# EAGLE design Mixer Console PCB (EAGLE 9.6.2)

## Sheet 1 of 6: 60DB Mic Preamp
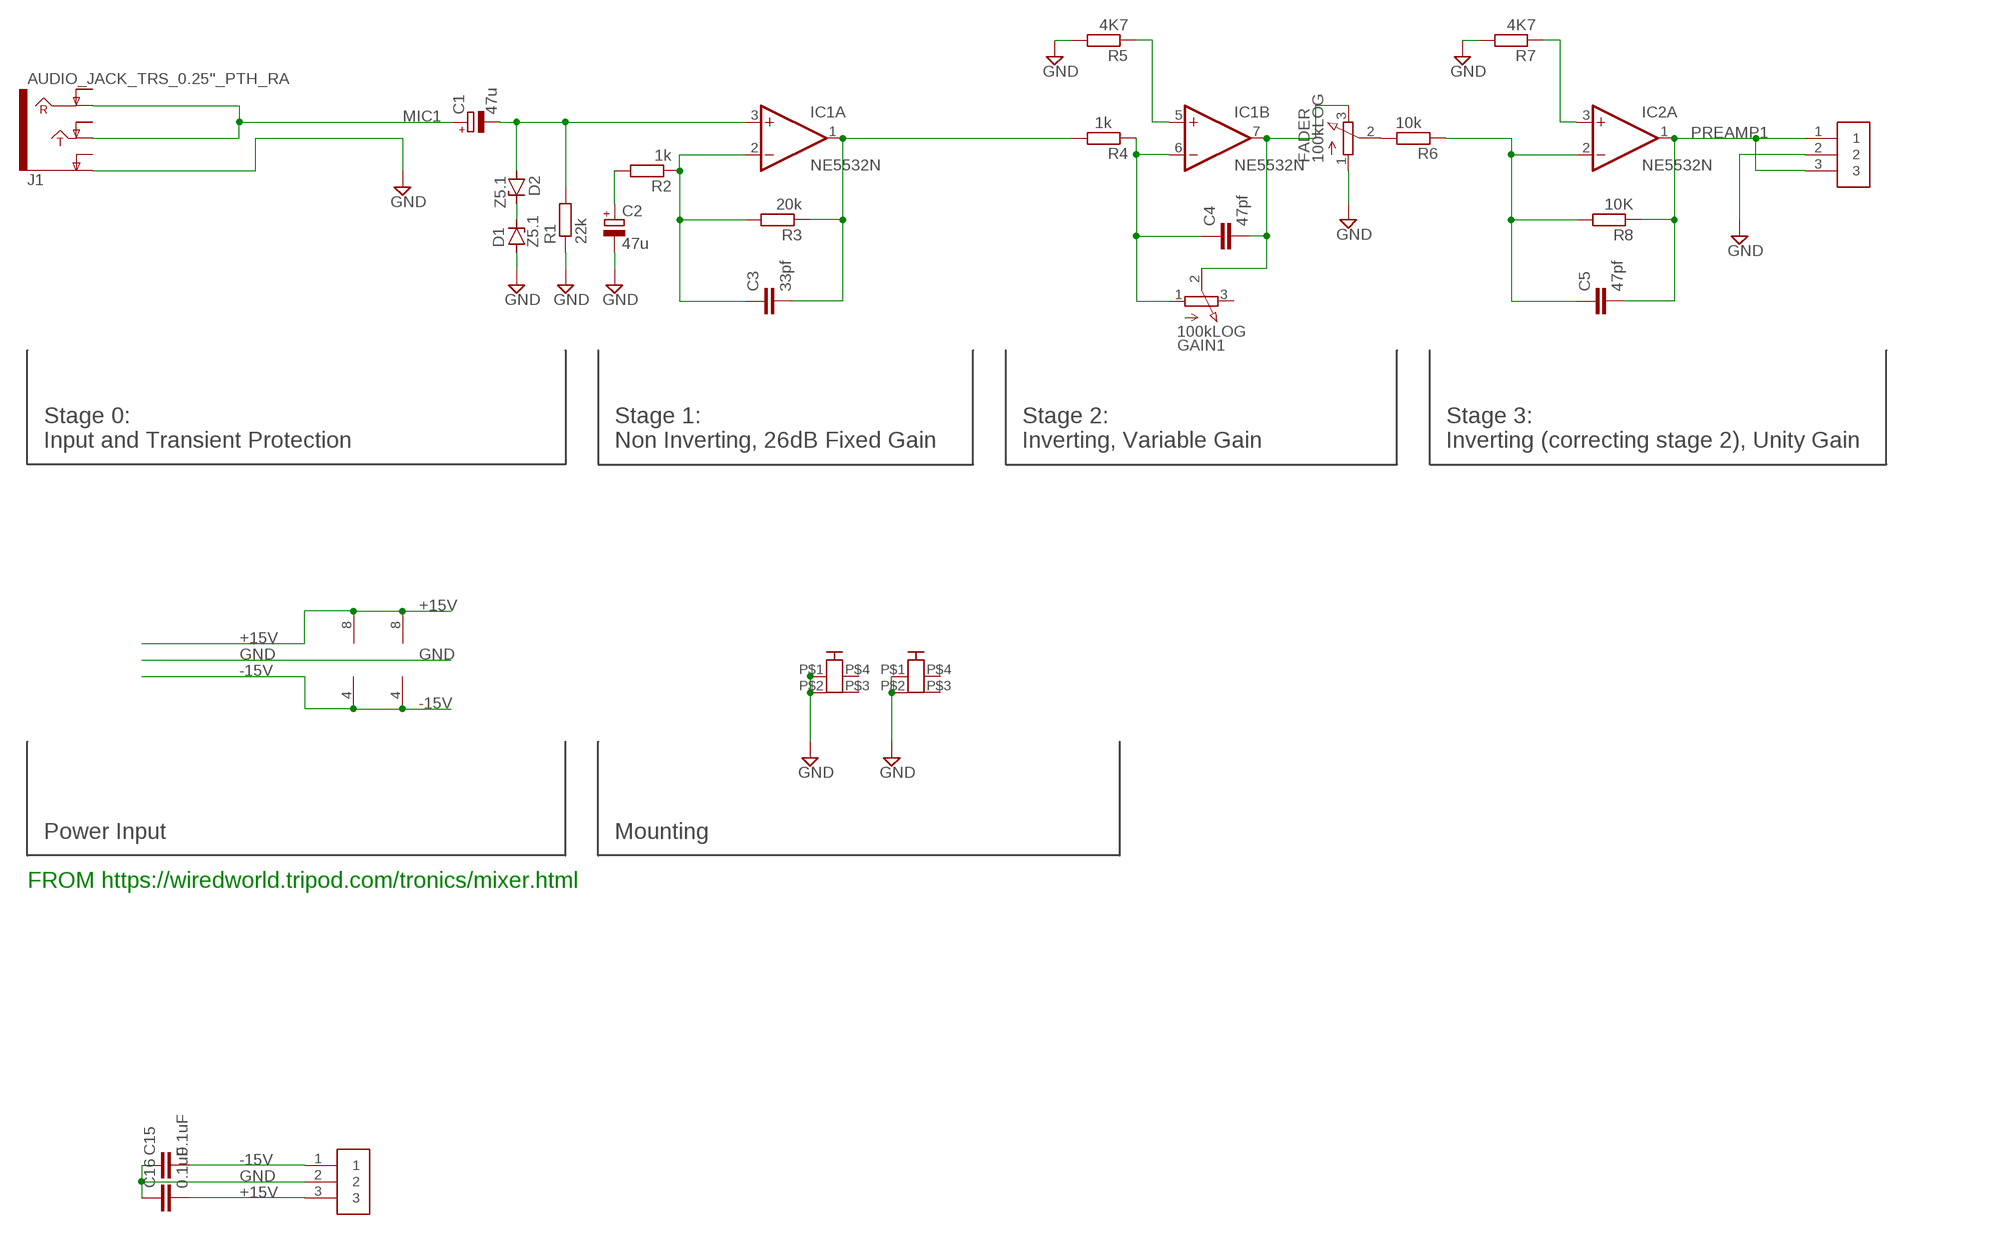
[diagram p0: schematic, sheet 1]

### Parts
C1  47u  CPOL-EUE5-6  [E5-6]
C2  47u  CPOL-EUE5-6  [E5-6]
C3  33pf  C2.5/2  [C2.5-2]
C4  47pf  C2.5/2  [C2.5-2]
C5  47pf  C2.5/2  [C2.5-2]
C15  0.1uF  C2.5/2  [C2.5-2]
C16  0.1uF  C2.5/2  [C2.5-2]
CON11  PCB-2M3  [PCB2-M3]
CON12  PCB-2M3  [PCB2-M3]
D1  Z5.1  ZENER-DIODEDO34-7  [DO34Z7]
D2  Z5.1  ZENER-DIODEDO34-7  [DO34Z7]
FADER  100kLOG  3RP/1610N  [3RP/1610N]
GAIN1  100kLOG  3RP/1610N  [3RP/1610N]
IC1  NE5532N  [DIL08]
IC2  NE5532N  [DIL08]
J1  AUDIO_JACK_TRS_0.25"_PTH_RA  [AUDIO_JACK_0.25"_TRS_PTH_RA]
PREAMPOUT  Phoenix Pluggable 3.81mm 3 way  CONNECTOR-M3  [3.81MM-3WAY-PLUGGABLE-SCREW]
PWRIN  Phoenix Pluggable 3.81mm 3 way  CONNECTOR-M3  [3.81MM-3WAY-PLUGGABLE-SCREW]
R1  22k  R-EU_0204/7  [0204/7]
R2  1k  R-EU_0204/7  [0204/7]
R3  20k  R-EU_0204/7  [0204/7]
R4  1k  R-EU_0204/7  [0204/7]
R5  4K7  R-EU_0204/7  [0204/7]
R6  10k  R-EU_0204/7  [0204/7]
R7  4K7  R-EU_0204/7  [0204/7]
R8  10K  R-EU_0204/7  [0204/7]

### Nets
+15V: C16.2 IC1.8(P:V+) IC2.8(P:V+) PWRIN.3 ; also sheet 2,3,4,5,6
-15V: C15.2 IC1.4(P:V-) IC2.4(P:V-) PWRIN.1 ; also sheet 2,3,4,5,6
GND: C2.- C15.1 C16.1 CON11.P$1 CON11.P$2 CON12.P$1 CON12.P$2 D1.A FADER.1(A) J1.SLEEVE(EARTH) PREAMPOUT.2 PWRIN.2 R1.1 R5.2 R7.2 ; also sheet 2,3,4,5,6
MIC1: C1.+ J1.RING J1.TIP
N$1: C1.- D2.A IC1.3(A:+IN) R1.2
N$2: C2.+ R2.2
N$3: C3.1 IC1.2(A:-IN) R2.1 R3.2
N$4: C3.2 IC1.1(A:OUT) R3.1 R4.2
N$5: C4.1 GAIN1.1(A) IC1.6(B:-IN) R4.1
N$6: IC1.5(B:+IN) R5.1
N$7: C4.2 FADER.3(E) GAIN1.2(S) IC1.7(B:OUT)
N$8: IC2.3(A:+IN) R7.1
N$9: D1.C D2.C
N$10: C5.1 IC2.2(A:-IN) R6.1 R8.2
N$18: FADER.2(S) R6.2
PREAMP1: C5.2 IC2.1(A:OUT) PREAMPOUT.1 PREAMPOUT.3 R8.1
Unconnected: CON11.P$3 CON11.P$4 CON12.P$3 CON12.P$4 GAIN1.3(E) IC2.5(B:+IN) IC2.6(B:-IN) IC2.7(B:OUT) J1.RING-NORM J1.SLEEVE-NORM(EARTH-NORM) J1.TIP-NORM

### Notes on the sheet
- Stage 0:
  Input and Transient Protection
- Stage 1: 
  Non Inverting, 26dB Fixed Gain
- Stage 2: 
  Inverting, Variable Gain
- Stage 3: 
  Inverting (correcting stage 2), Unity Gain
- Power Input | Mounting
- FROM https://wiredworld.tripod.com/tronics/mixer.html

## Sheet 2 of 6: BAXANDALL EQ
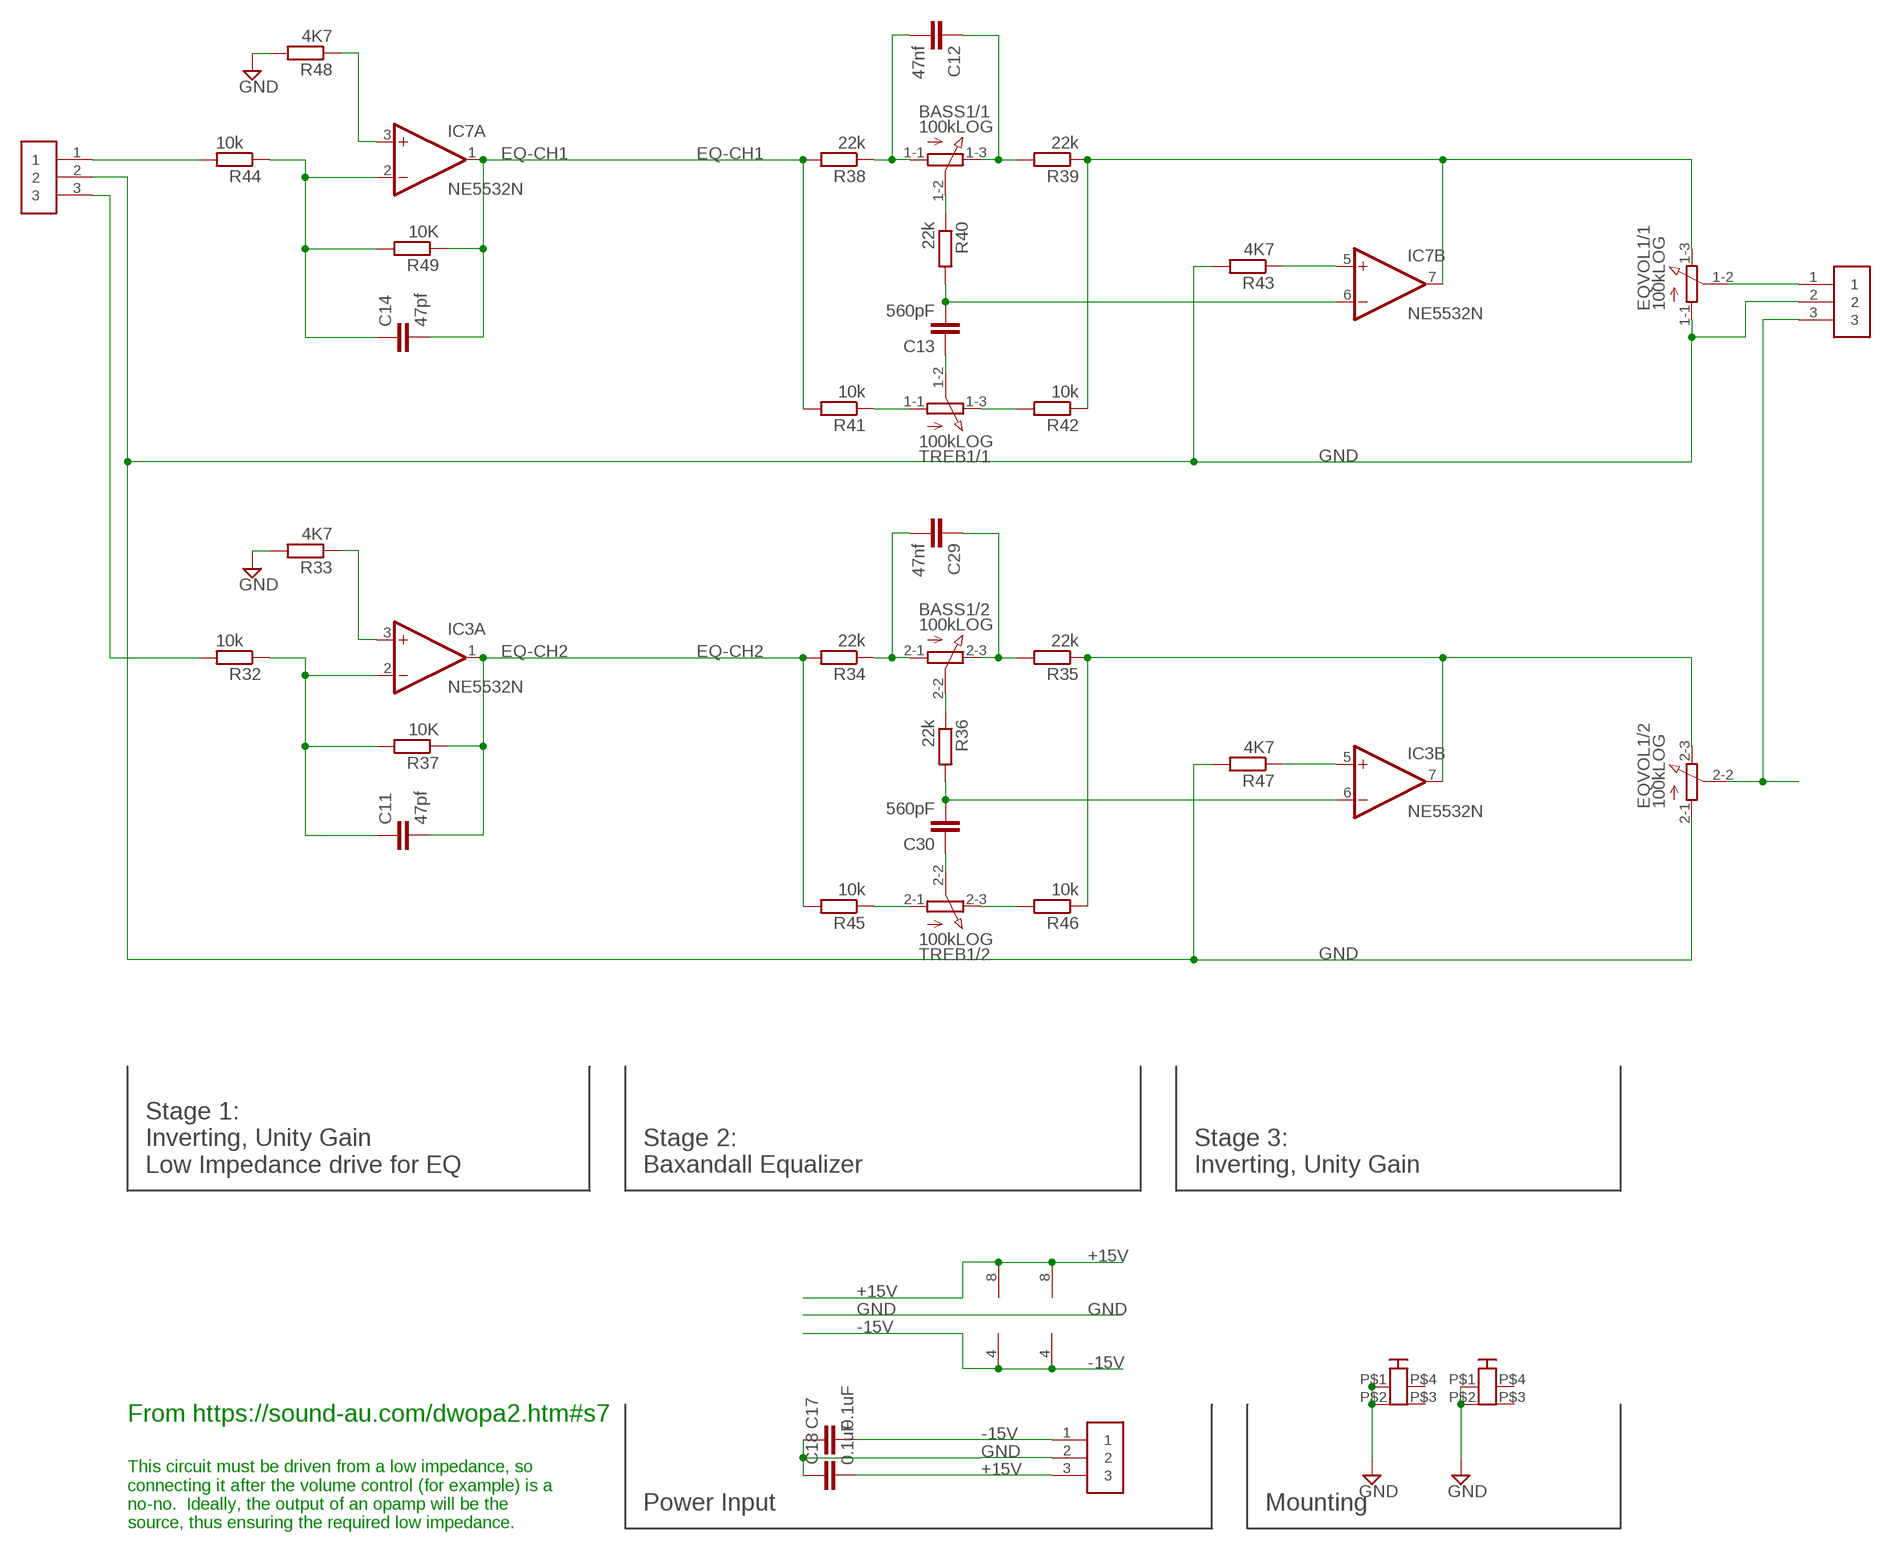
[diagram p1: schematic, sheet 2]

### Parts
BASS1  100kLOG  3RP/1610G  [3RP/1610G]
C11  47pf  C2.5/2  [C2.5-2]
C12  47nf  C2.5/2  [C2.5-2]
C13  560pF  C2.5/2  [C2.5-2]
C14  47pf  C2.5/2  [C2.5-2]
C17  0.1uF  C2.5/2  [C2.5-2]
C18  0.1uF  C2.5/2  [C2.5-2]
C29  47nf  C2.5/2  [C2.5-2]
C30  560pF  C2.5/2  [C2.5-2]
CON1  PCB-2M3  [PCB2-M3]
CON2  PCB-2M3  [PCB2-M3]
EQIN  Phoenix Pluggable 3.81mm 3 way  CONNECTOR-M3  [3.81MM-3WAY-PLUGGABLE-SCREW]
EQOUT  Phoenix Pluggable 3.81mm 3 way  CONNECTOR-M3  [3.81MM-3WAY-PLUGGABLE-SCREW]
EQVOL1  100kLOG  3RP/1610G  [3RP/1610G]
IC3  NE5532N  [DIL08]
IC7  NE5532N  [DIL08]
PWRIN1  Phoenix Pluggable 3.81mm 3 way  CONNECTOR-M3  [3.81MM-3WAY-PLUGGABLE-SCREW]
R32  10k  R-EU_0204/7  [0204/7]
R33  4K7  R-EU_0204/7  [0204/7]
R34  22k  R-EU_0204/7  [0204/7]
R35  22k  R-EU_0204/7  [0204/7]
R36  22k  R-EU_0204/7  [0204/7]
R37  10K  R-EU_0204/7  [0204/7]
R38  22k  R-EU_0204/7  [0204/7]
R39  22k  R-EU_0204/7  [0204/7]
R40  22k  R-EU_0204/7  [0204/7]
R41  10k  R-EU_0204/7  [0204/7]
R42  10k  R-EU_0204/7  [0204/7]
R43  4K7  R-EU_0204/7  [0204/7]
R44  10k  R-EU_0204/7  [0204/7]
R45  10k  R-EU_0204/7  [0204/7]
R46  10k  R-EU_0204/7  [0204/7]
R47  4K7  R-EU_0204/7  [0204/7]
R48  4K7  R-EU_0204/7  [0204/7]
R49  10K  R-EU_0204/7  [0204/7]
TREB1  100kLOG  3RP/1610G  [3RP/1610G]

### Nets
+15V: C18.2 IC3.8(P:V+) IC7.8(P:V+) PWRIN1.3 ; also sheet 1,3,4,5,6
-15V: C17.2 IC3.4(P:V-) IC7.4(P:V-) PWRIN1.1 ; also sheet 1,3,4,5,6
EQ-CH1: C14.2 IC7.1(A:OUT) R38.2 R41.2 R49.1
EQ-CH2: C11.2 IC3.1(A:OUT) R34.2 R37.1 R45.2
GND: C17.1 C18.1 CON1.P$1 CON1.P$2 CON2.P$1 CON2.P$2 EQIN.2 EQOUT.2 EQVOL1.1-1(/1:A) EQVOL1.2-1(/2:A) PWRIN1.2 R33.2 R43.2 R47.2 R48.2 ; also sheet 1,3,4,5,6
N$11: EQOUT.3 EQVOL1.2-2(/2:S)
N$12: IC3.3(A:+IN) R33.1
N$15: C11.1 IC3.2(A:-IN) R32.1 R37.2
N$23: EQIN.3 R32.2
N$36: BASS1.1-1(/1:A) C12.2 R38.1
N$42: BASS1.1-3(/1:E) C12.1 R39.2
N$43: BASS1.2-1(/2:A) C29.2 R34.1
N$44: BASS1.2-3(/2:E) C29.1 R35.2
N$45: BASS1.1-2(/1:S) R40.1
N$46: BASS1.2-2(/2:S) R36.1
N$47: C13.2 IC7.6(B:-IN) R40.2
N$48: C13.1 TREB1.1-2(/1:S)
N$49: C30.2 IC3.6(B:-IN) R36.2
N$50: EQVOL1.1-3(/1:E) IC7.7(B:OUT) R39.1 R42.1
N$51: R42.2 TREB1.1-3(/1:E)
N$52: C30.1 TREB1.2-2(/2:S)
N$53: R41.1 TREB1.1-1(/1:A)
N$54: IC7.5(B:+IN) R43.1
N$55: EQVOL1.2-3(/2:E) IC3.7(B:OUT) R35.1 R46.1
N$56: EQOUT.1 EQVOL1.1-2(/1:S)
N$57: R46.2 TREB1.2-3(/2:E)
N$58: R45.1 TREB1.2-1(/2:A)
N$59: IC7.3(A:+IN) R48.1
N$60: C14.1 IC7.2(A:-IN) R44.1 R49.2
N$61: EQIN.1 R44.2
N$65: IC3.5(B:+IN) R47.1
Unconnected: CON1.P$3 CON1.P$4 CON2.P$3 CON2.P$4

### Notes on the sheet
- Stage 1:
  Inverting, Unity Gain
  Low Impedance drive for EQ
- Stage 2:
  Baxandall Equalizer
- Stage 3:
  Inverting, Unity Gain
- From https://sound-au.com/dwopa2.htm#s7
- Power Input | Mounting
- This circuit must be driven from a low impedance, so
  connecting it after the volume control (for example) is a
  no-no.  Ideally, the output of an opamp will be the
  source, thus ensuring the required low impedance.

## Sheet 3 of 6: STEREO INPUT
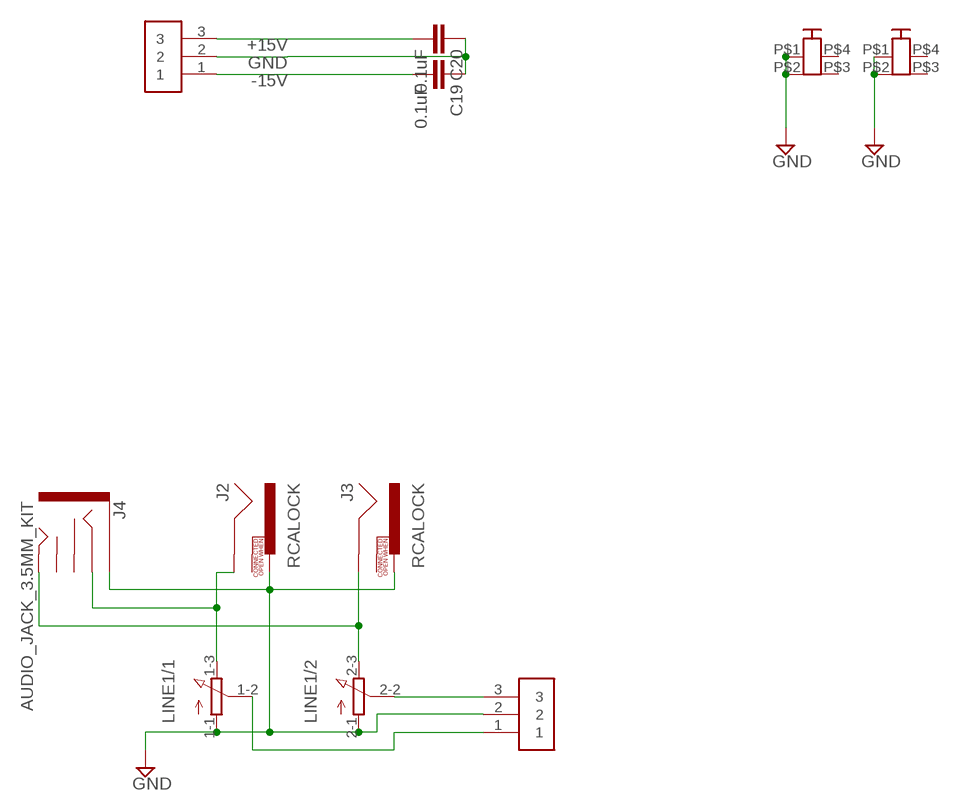
[diagram p2: schematic, sheet 3]

### Parts
C19  0.1uF  C2.5/2  [C2.5-2]
C20  0.1uF  C2.5/2  [C2.5-2]
CON3  PCB-2M3  [PCB2-M3]
CON4  PCB-2M3  [PCB2-M3]
J2  RCALOCK  [RCA_LOCK]
J3  RCALOCK  [RCA_LOCK]
J4  AUDIO_JACK_3.5MM_KIT  [AUDIO-JACK-KIT]
LINE1  3RP/1610G  [3RP/1610G]
LINEIN-OUT  Phoenix Pluggable 3.81mm 3 way  CONNECTOR-M3  [3.81MM-3WAY-PLUGGABLE-SCREW]
PWRIN2  Phoenix Pluggable 3.81mm 3 way  CONNECTOR-M3  [3.81MM-3WAY-PLUGGABLE-SCREW]

### Nets
+15V: C20.2 PWRIN2.3 ; also sheet 1,2,4,5,6
-15V: C19.2 PWRIN2.1 ; also sheet 1,2,4,5,6
GND: C19.1 C20.1 CON3.P$1 CON3.P$2 CON4.P$1 CON4.P$2 J2.PIN J3.PIN J4.SLEEVE LINE1.1-1(/1:A) LINE1.2-1(/2:A) LINEIN-OUT.2 PWRIN2.2 ; also sheet 1,2,4,5,6
N$16: LINE1.2-2(/2:S) LINEIN-OUT.3
N$17: LINE1.1-2(/1:S) LINEIN-OUT.1
N$19: J2.SHELL J4.RING LINE1.1-3(/1:E)
N$20: J3.SHELL J4.TIP LINE1.2-3(/2:E)
Unconnected: CON3.P$3 CON3.P$4 CON4.P$3 CON4.P$4 J2.SWITCH J3.SWITCH J4.RSH J4.TSH

## Sheet 4 of 6: MIXER
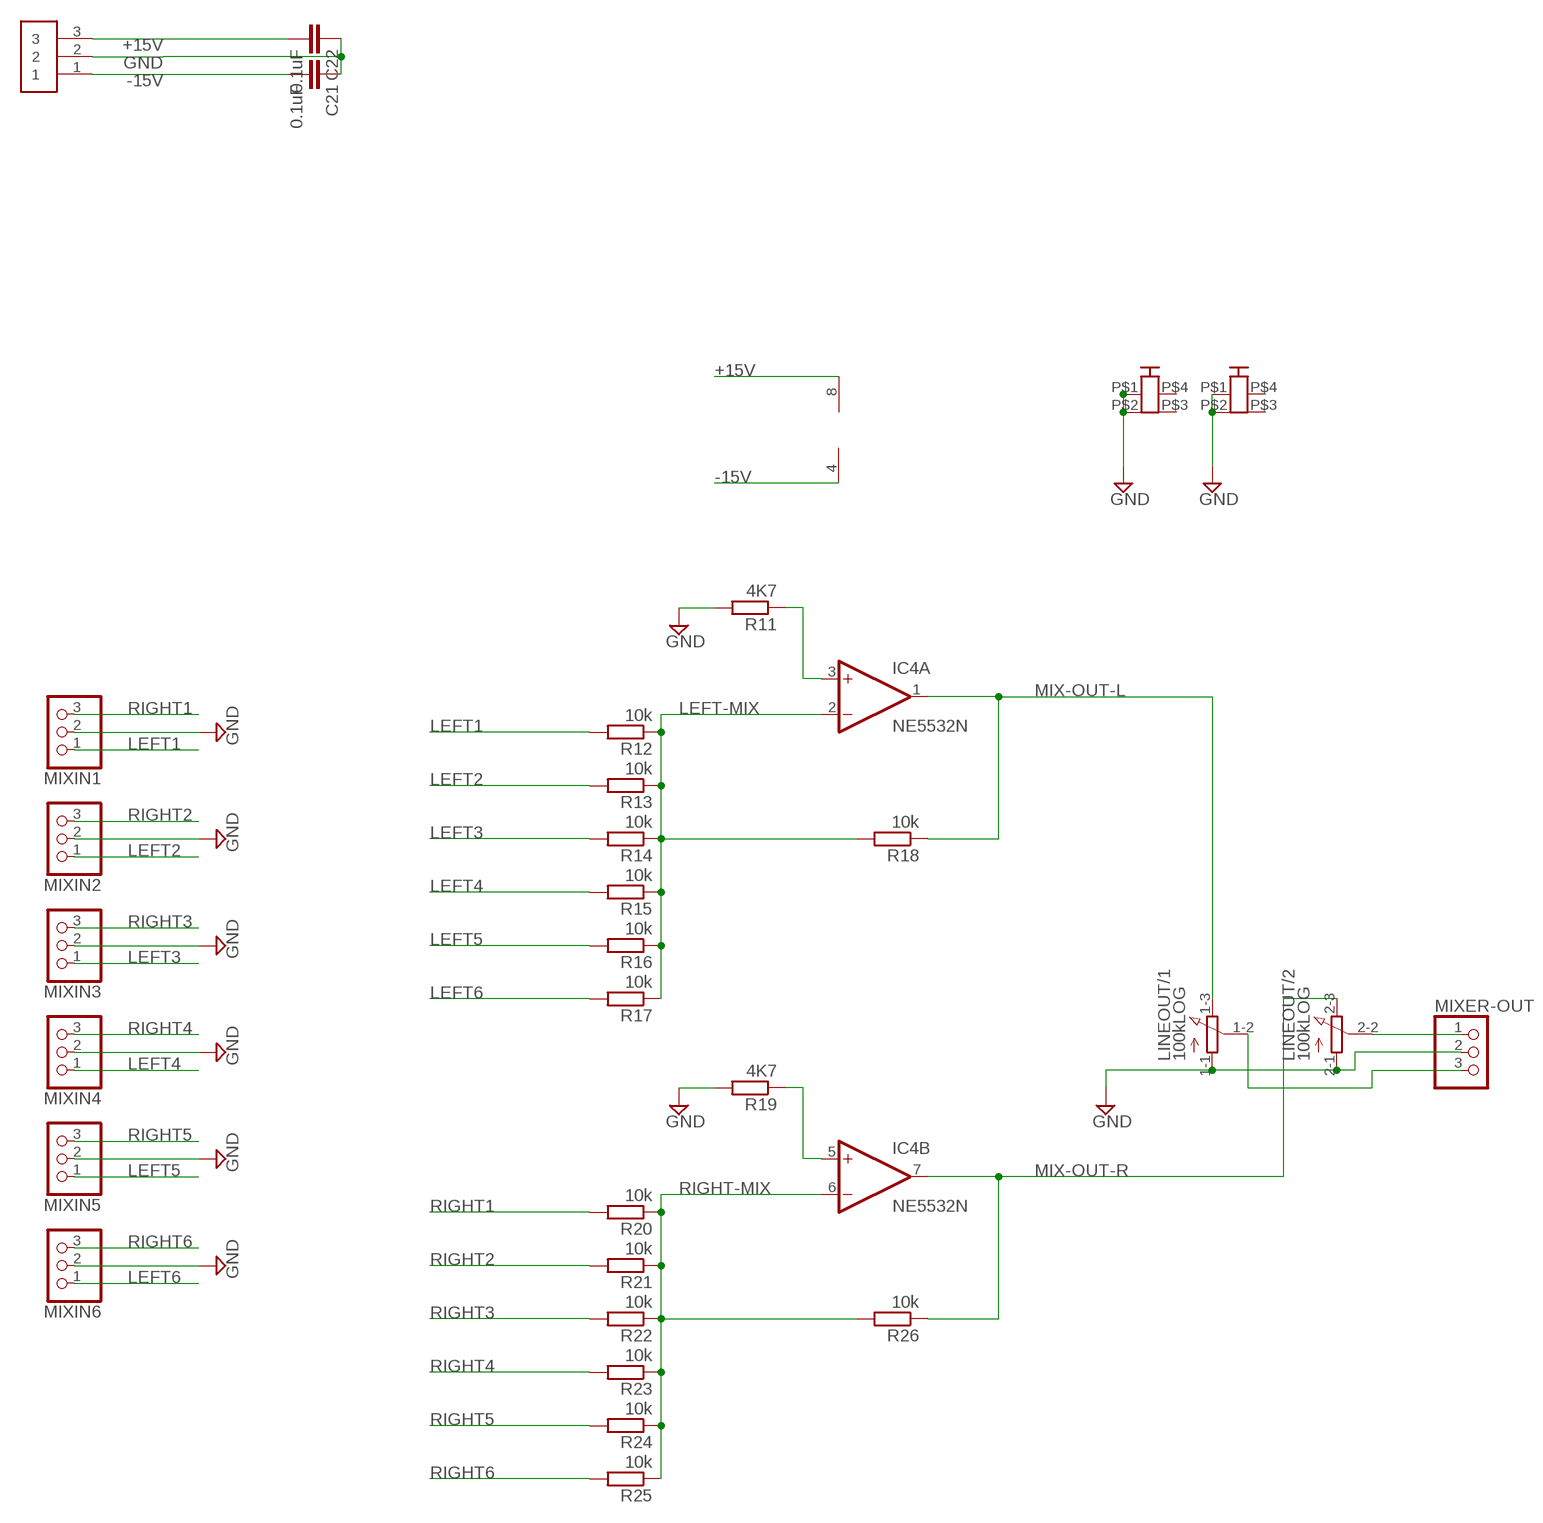
[diagram p3: schematic, sheet 4]

### Parts
C21  0.1uF  C2.5/2  [C2.5-2]
C22  0.1uF  C2.5/2  [C2.5-2]
CON5  PCB-2M3  [PCB2-M3]
CON6  PCB-2M3  [PCB2-M3]
IC4  NE5532N  [DIL08]
LINEOUT  100kLOG  3RP/1610G  [3RP/1610G]
MIXER-OUT  PINHD-1X3/90  [1X03/90]
MIXIN1  PINHD-1X3/90  [1X03/90]
MIXIN2  PINHD-1X3/90  [1X03/90]
MIXIN3  PINHD-1X3/90  [1X03/90]
MIXIN4  PINHD-1X3/90  [1X03/90]
MIXIN5  PINHD-1X3/90  [1X03/90]
MIXIN6  PINHD-1X3/90  [1X03/90]
PWRIN3  Phoenix Pluggable 3.81mm 3 way  CONNECTOR-M3  [3.81MM-3WAY-PLUGGABLE-SCREW]
R11  4K7  R-EU_0204/7  [0204/7]
R12  10k  R-EU_0204/7  [0204/7]
R13  10k  R-EU_0204/7  [0204/7]
R14  10k  R-EU_0204/7  [0204/7]
R15  10k  R-EU_0204/7  [0204/7]
R16  10k  R-EU_0204/7  [0204/7]
R17  10k  R-EU_0204/7  [0204/7]
R18  10k  R-EU_0204/7  [0204/7]
R19  4K7  R-EU_0204/7  [0204/7]
R20  10k  R-EU_0204/7  [0204/7]
R21  10k  R-EU_0204/7  [0204/7]
R22  10k  R-EU_0204/7  [0204/7]
R23  10k  R-EU_0204/7  [0204/7]
R24  10k  R-EU_0204/7  [0204/7]
R25  10k  R-EU_0204/7  [0204/7]
R26  10k  R-EU_0204/7  [0204/7]

### Nets
+15V: C22.2 IC4.8(P:V+) PWRIN3.3 ; also sheet 1,2,3,5,6
-15V: C21.2 IC4.4(P:V-) PWRIN3.1 ; also sheet 1,2,3,5,6
GND: C21.1 C22.1 CON5.P$1 CON5.P$2 CON6.P$1 CON6.P$2 LINEOUT.1-1(/1:A) LINEOUT.2-1(/2:A) MIXER-OUT.2 MIXIN1.2 MIXIN2.2 MIXIN3.2 MIXIN4.2 MIXIN5.2 MIXIN6.2 PWRIN3.2 R11.2 R19.2 ; also sheet 1,2,3,5,6
LEFT1: MIXIN1.1 R12.2
LEFT2: MIXIN2.1 R13.2
LEFT3: MIXIN3.1 R14.2
LEFT4: MIXIN4.1 R15.2
LEFT5: MIXIN5.1 R16.2
LEFT6: MIXIN6.1 R17.2
LEFT-MIX: IC4.2(A:-IN) R12.1 R13.1 R14.1 R15.1 R16.1 R17.1 R18.2
MIX-OUT-L: IC4.1(A:OUT) LINEOUT.1-3(/1:E) R18.1
MIX-OUT-R: IC4.7(B:OUT) LINEOUT.2-3(/2:E) R26.1
N$13: IC4.5(B:+IN) R19.1
N$14: IC4.3(A:+IN) R11.1
N$21: LINEOUT.2-2(/2:S) MIXER-OUT.1
N$22: LINEOUT.1-2(/1:S) MIXER-OUT.3
RIGHT1: MIXIN1.3 R20.2
RIGHT2: MIXIN2.3 R21.2
RIGHT3: MIXIN3.3 R22.2
RIGHT4: MIXIN4.3 R23.2
RIGHT5: MIXIN5.3 R24.2
RIGHT6: MIXIN6.3 R25.2
RIGHT-MIX: IC4.6(B:-IN) R20.1 R21.1 R22.1 R23.1 R24.1 R25.1 R26.2
Unconnected: CON5.P$3 CON5.P$4 CON6.P$3 CON6.P$4

## Sheet 5 of 6: VU METER
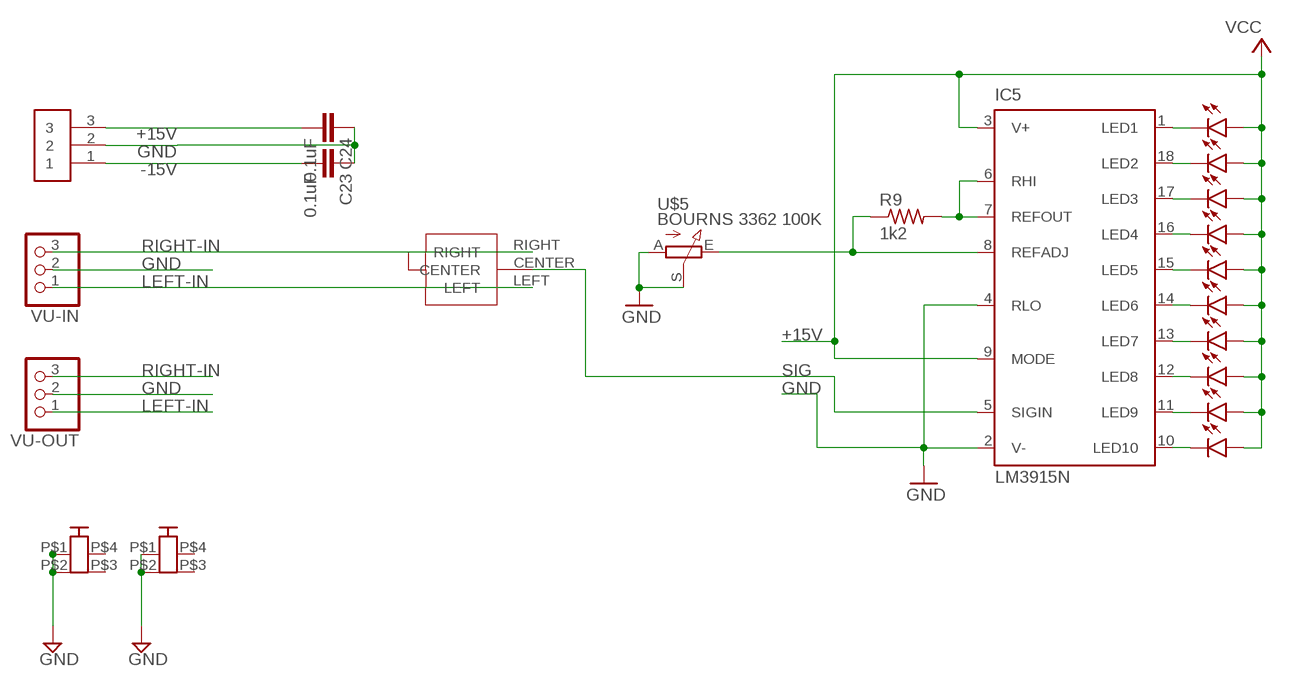
[diagram p4: schematic, sheet 5]

### Parts
C23  0.1uF  C2.5/2  [C2.5-2]
C24  0.1uF  C2.5/2  [C2.5-2]
CON7  PCB-2M3  [PCB2-M3]
CON8  PCB-2M3  [PCB2-M3]
IC5  LM3915N  [DIL18]
LED1  LED3MM  [LED3MM]
LED2  LED3MM  [LED3MM]
LED3  LED3MM  [LED3MM]
LED4  LED3MM  [LED3MM]
LED5  LED3MM  [LED3MM]
LED6  LED3MM  [LED3MM]
LED7  LED3MM  [LED3MM]
LED8  LED3MM  [LED3MM]
LED9  LED3MM  [LED3MM]
LED10  LED3MM  [LED3MM]
PWRIN4  Phoenix Pluggable 3.81mm 3 way  CONNECTOR-M3  [3.81MM-3WAY-PLUGGABLE-SCREW]
R9  1k2  R-US_0207/10  [0207/10]
U$2  XKBENTERPRISESS-12D11G5R  [XKBENTERPRISESS-12D11G5R]
U$5  BOURNS 3362 100K  POTVERTICAL  [POT_B64W]
VU-IN  PINHD-1X3/90  [1X03/90]
VU-OUT  PINHD-1X3/90  [1X03/90]

### Nets
+15V: C24.2 IC5.3(V+) IC5.9(MODE) LED1.A LED2.A LED3.A LED4.A LED5.A LED6.A LED7.A LED8.A LED9.A LED10.A PWRIN4.3 ; supply symbol labelled VCC ; also sheet 1,2,3,4,6
-15V: C23.2 PWRIN4.1 ; also sheet 1,2,3,4,6
GND: C23.1 C24.1 CON7.P$1 CON7.P$2 CON8.P$1 CON8.P$2 IC5.2(V-) IC5.4(RLO) PWRIN4.2 U$5.A U$5.S VU-IN.2 VU-OUT.2 ; also sheet 1,2,3,4,6
LEFT-IN: U$2.LEFT VU-IN.1 VU-OUT.1
N$24: IC5.6(RHI) IC5.7(REFOUT) R9.2
N$25: IC5.1(LED1) LED1.K(C)
N$26: IC5.18(LED2) LED2.K(C)
N$27: IC5.17(LED3) LED3.K(C)
N$28: IC5.16(LED4) LED4.K(C)
N$29: IC5.15(LED5) LED5.K(C)
N$30: IC5.14(LED6) LED6.K(C)
N$31: IC5.13(LED7) LED7.K(C)
N$32: IC5.12(LED8) LED8.K(C)
N$33: IC5.11(LED9) LED9.K(C)
N$34: IC5.10(LED10) LED10.K(C)
REF: IC5.8(REFADJ) R9.1 U$5.E
RIGHT-IN: U$2.RIGHT VU-IN.3 VU-OUT.3
SIG: IC5.5(SIGIN) U$2.CENTER
Unconnected: CON7.P$3 CON7.P$4 CON8.P$3 CON8.P$4

## Sheet 6 of 6: FUZZ EFFECT
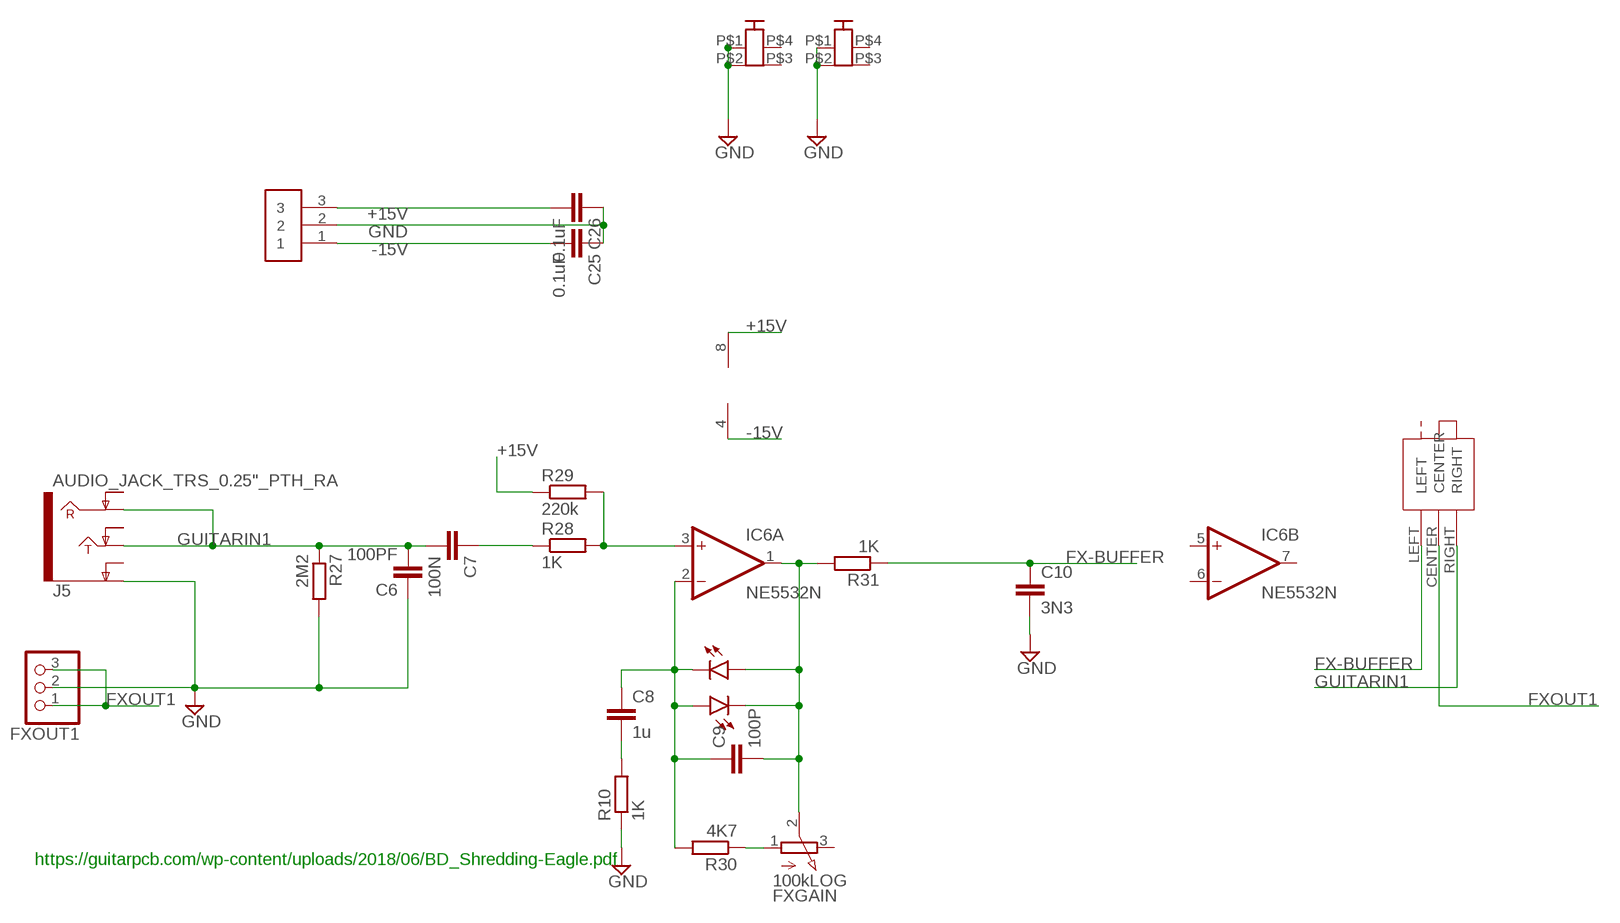
[diagram p5: schematic, sheet 6]

### Parts
C6  100PF  C2.5/2  [C2.5-2]
C7  100N  C2.5/2  [C2.5-2]
C8  1u  C2.5/2  [C2.5-2]
C9  100P  C2.5/2  [C2.5-2]
C10  3N3  C2.5/2  [C2.5-2]
C25  0.1uF  C2.5/2  [C2.5-2]
C26  0.1uF  C2.5/2  [C2.5-2]
CON9  PCB-2M3  [PCB2-M3]
CON10  PCB-2M3  [PCB2-M3]
FXGAIN  100kLOG  3RP/1610N  [3RP/1610N]
FXOUT1  PINHD-1X3/90  [1X03/90]
IC6  NE5532N  [DIL08]
J5  AUDIO_JACK_TRS_0.25"_PTH_RA  [AUDIO_JACK_0.25"_TRS_PTH_RA]
LED11  LED3MM  [LED3MM]
LED12  LED3MM  [LED3MM]
PWRIN5  Phoenix Pluggable 3.81mm 3 way  CONNECTOR-M3  [3.81MM-3WAY-PLUGGABLE-SCREW]
R10  1K  R-EU_0204/7  [0204/7]
R27  2M2  R-EU_0204/7  [0204/7]
R28  1K  R-EU_0204/7  [0204/7]
R29  220k  R-EU_0204/7  [0204/7]
R30  4K7  R-EU_0204/7  [0204/7]
R31  1K  R-EU_0204/7  [0204/7]
U$1  XKBENTERPRISESS-12D11G5R  [XKBENTERPRISESS-12D11G5R]

### Nets
+15V: C26.2 IC6.8(P:V+) PWRIN5.3 R29.1 ; also sheet 1,2,3,4,5
-15V: C25.2 IC6.4(P:V-) PWRIN5.1 ; also sheet 1,2,3,4,5
FX-BUFFER: C10.1 R31.1 U$1.LEFT
FXOUT1: FXOUT1.1 FXOUT1.3 U$1.CENTER
GND: C6.1 C10.2 C25.1 C26.1 CON9.P$1 CON9.P$2 CON10.P$1 CON10.P$2 FXOUT1.2 J5.SLEEVE(EARTH) PWRIN5.2 R10.1 R27.2 ; also sheet 1,2,3,4,5
GUITARIN1: C6.2 C7.2 J5.RING J5.TIP R27.1 U$1.RIGHT
N$35: IC6.3(A:+IN) R28.2 R29.2
N$37: C7.1 R28.1
N$38: C8.1 C9.1 IC6.2(A:-IN) LED11.K(C) LED12.A R30.2
N$39: C9.2 FXGAIN.2(S) IC6.1(A:OUT) LED11.A LED12.K(C) R31.2
N$40: C8.2 R10.2
N$41: FXGAIN.1(A) R30.1
Unconnected: CON9.P$3 CON9.P$4 CON10.P$3 CON10.P$4 FXGAIN.3(E) IC6.5(B:+IN) IC6.6(B:-IN) IC6.7(B:OUT) J5.RING-NORM J5.SLEEVE-NORM(EARTH-NORM) J5.TIP-NORM

### Notes on the sheet
- https://guitarpcb.com/wp-content/uploads/2018/06/BD_Shredding-Eagle.pdf

## Library data of the parts
BASS1 EQVOL1 TREB1 = pot:3RP/1610G: 16mm Potentiometer two level Source: http://www.alphapotentiometers.net/html/16mm_pot_2.html; SPICEPREFIX: J
C1 C2 = rcl:CPOL-EU: POLARIZED CAPACITOR, European symbol; SPICEPREFIX: C
C3-C26 C29 C30 = capacitor-wima:C: CAPACITOR naming: grid - package width
CON1-CON12 = Screw Terminals:PCB-2M3
D1 D2 = diode:ZENER-DIODE: Z-Diode
EQIN EQOUT LINEIN-OUT PREAMPOUT PWRIN PWRIN1-PWRIN5 = openbuilds-eagle-library:CONNECTOR-M3
FADER FXGAIN GAIN1 = pot:3RP/1610N: 16mm Potentiometer one level Source: http://www.alphapotentiometers.net/html/16mm_pot_2.html
FXOUT1 MIXER-OUT MIXIN1-MIXIN6 VU-IN VU-OUT = pinhead:PINHD-1X3: PIN HEADER
IC1-IC4 IC6 IC7 = linear:NE5532: AUDIO AMPLIFIER
IC5 = national-semiconductor:LM391: Dot/Bar Display Driver Source: Data sheet LM3915 <http://www.national.com/ds/LM/LM3915.pdf> Data sheet LM3914 <http://www.national.com/ds/LM/LM3914.pdf>
J1 J5 = SparkFun-Connectors:AUDIO_JACK_TRS_0.25"_PTH_RA: Audio Jack, 1/4" TRS jack, horizontal, PTH, aka "Phono jack" Find the connector here: Audio Jack - 1/4" Stereo (right angle) <https://www.sparkfun.com/products/11144> (COM-11144) Datasheet <http://cdn.sparkfun.com/datasheets/Components/General/JP-611%20DD.jpg> Note, although the datasheet and physical part are slightly different, this footprint was proven to mate well on the Proto Pedal. This device is used on these SparkFun Products: SparkFun TRS Jack Breakout - 1/4" Stereo <https://www.sparkfun.com/products/13005> (BOB-13005 ) SparkFun Proto Pedal - sorry bad link - product comming soon! <https://www.sparkfun.com/products/13124> (PRT-13124); PROD_ID: CONN-12339; SF_ID: COM-11144
J2 J3 = SparkFun-Connectors:RCA: RCA Jack connector This is a right angle RCA jack connecotr. Commonly used for video or audio. Here is the connector we sell at SparkFun: RCA Jack <https://www.sparkfun.com/products/8631> (PRT-08631) Datasheet <http://www.sparkfun.com/datasheets/Prototyping/Connectors/RCA-Jack.pdf> It is not used on any active designs, however it was used on a couple retired products: RCA Jack Breakout [RETIRED] <https://www.sparkfun.com/products/8826> (PRT-08826) SparkFun On Screen Display Breakout - MAX7456 [RETIRED] <https://www.sparkfun.com/products/9168> (BOB-09168) You may also be interested in a cable: RCA Video Cable - 6' <https://www.sparkfun.com/products/11573> (CAB-11573)
J4 = SparkFun-Connectors:AUDIO_JACK_3.5MM: Audio Jack 3.5mm variants of PTH and SMT stereo audio jack with bypass switches. SparkFun Products: SparkFun SparkPunk Sound Kit <[https://www.sparkfun.com/products/11177]> - PTH MP3 Trigger <https://www.sparkfun.com/products/13720> -3.5mm SMD SparkFun PicoBoard <https://www.sparkfun.com/products/11888>- 2.5mm SMD; PROD_ID: CONN-08774; SF_ID: PRT-08032
LED1-LED12 = led:LED: LED OSRAM: - CHIPLED LG R971, LG N971, LY N971, LG Q971, LY Q971, LO R971, LY R971 LH N974, LH R974 LS Q976, LO Q976, LY Q976 LO Q996 - Hyper CHIPLED LW Q18S LB Q993, LB Q99A, LB R99A - SideLED LS A670, LO A670, LY A670, LG A670, LP A670 LB A673, LV A673, LT A673, LW A673 LH A674 LY A675 LS A676, LA A676, LO A676, LY A676, LW A676 LS A679, LY A679, LG A679 - Hyper Micro SIDELED® LS Y876, LA Y876, LO Y876, LY Y876 LT Y87S - SmartLED LW L88C, LW L88S LB L89C, LB L89S, LG L890 LS L89K, LO L89K, LY L89K LS L896, LA L896, LO L896, LY L896 - TOPLED LS T670, LO T670, LY T670, LG T670, LP T670 LSG T670, LSP T670, LSY T670, LOP T670, LYG T670 LG T671, LOG T671, LSG T671 LB T673, LV T673, LT T673, LW T673 LH T674 LS T676, LA T676, LO T676, LY T676, LB T676, LH T676, LSB T676, LW T676 LB T67C, LV T67C, LT T67C, LS T67K, LO T67K, LY T67K, LW E67C LS E67B, LA E67B, LO E67B, LY E67B, LB E67C, LV E67C, LT E67C LW T67C LS T679, LY T679, LG T679 LS T770, LO T770, LY T770, LG T770, LP T770 LB T773, LV T773, LT T773, LW T773 LH T774 LS E675, LA E675, LY E675, LS T675 LS T776, LA T776, LO T776, LY T776, LB T776 LHGB T686 LT T68C, LB T68C - Hyper Mini TOPLED® LB M676 - Mini TOPLED Santana® LG M470 LS M47K, LO M47K, LY M47K Source: http://www.osram.convergy.de LUXEON: - LUMILED® LXK2-PW12-R00, LXK2-PW12-S00, LXK2-PW14-U00, LXK2-PW14-V00 LXK2-PM12-R00, LXK2-PM12-S00, LXK2-PM14-U00 LXK2-PE12-Q00, LXK2-PE12-R00, LXK2-PE12-S00, LXK2-PE14-T00, LXK2-PE14-U00 LXK2-PB12-K00, LXK2-PB12-L00, LXK2-PB12-M00, LXK2-PB14-N00, LXK2-PB14-P00, LXK2-PB14-Q00 LXK2-PR12-L00, LXK2-PR12-M00, LXK2-PR14-Q00, LXK2-PR14-R00 LXK2-PD12-Q00, LXK2-PD12-R00, LXK2-PD12-S00 LXK2-PH12-R00, LXK2-PH12-S00 LXK2-PL12-P00, LXK2-PL12-Q00, LXK2-PL12-R00 Source: www.luxeon.com KINGBRIGHT: KA-3528ASYC Source: www.kingbright.com
LINE1 LINEOUT = pot:3RP/1610G: 16mm Potentiometer two level Source: http://www.alphapotentiometers.net/html/16mm_pot_2.html
R1-R8 R10-R49 = rcl:R-EU_: RESISTOR, European symbol; SPICEPREFIX: R
R9 = rcl:R-US_: RESISTOR, American symbol; SPICEPREFIX: R
U$1 U$2 = XKB Enterprise SS-12D11G5R:XKBENTERPRISESS-12D11G5R
U$5 = presetpot:POTVERTICAL

## Board
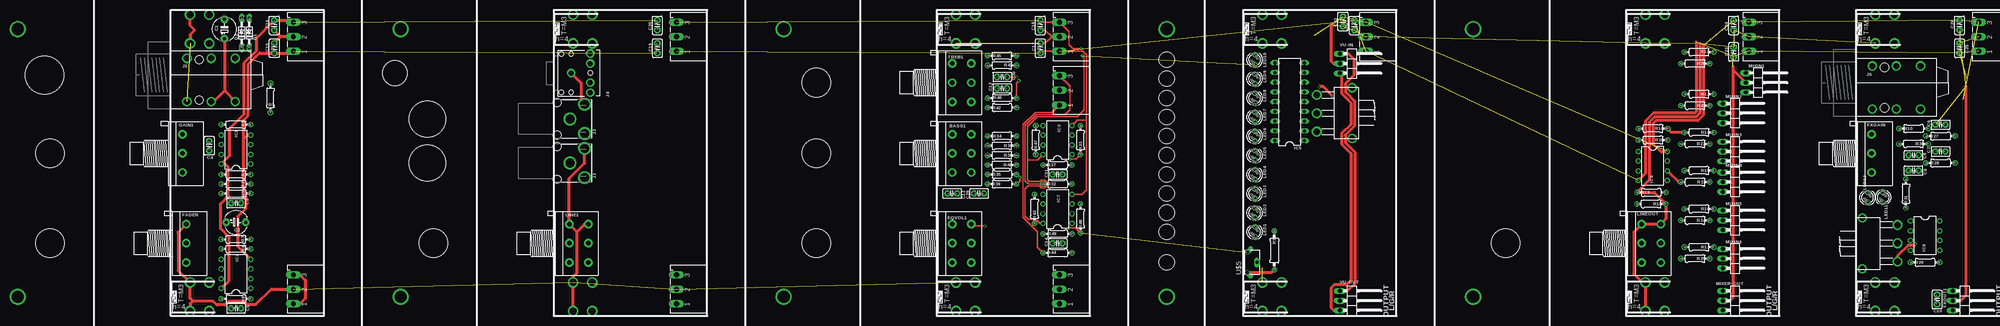
[diagram p6: board, top side]
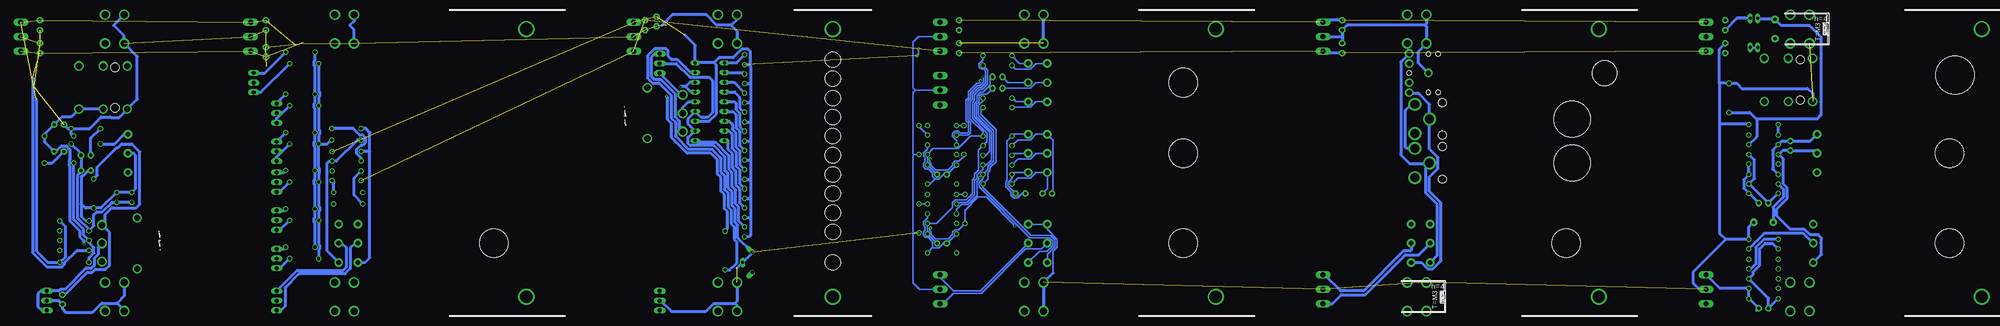
[diagram p7: board, bottom side, seen from below]

No outline drawn. Coordinates in mm, seen from the top.
Copper layers (1*16): Top 0.035mm / dielectric 1.5mm / Bottom 0.035mm
Design rules "default": minimum track width 6mil, minimum drill 0.35mm, track to track 6mil, track to pad 6mil, pad to pad 6mil, via to via 6mil, smd to smd 6mil, copper to edge 40mil, drill to drill 6mil, minimum pad ring 10mil, minimum via ring 8mil, stop-mask expansion 4mil, vias tented up to drill 0mil, thermal gap 10mil
Holes 7.5 mm at -171.5,42.5 -171.5,19 -71.5,19 28.5,42.5 28.5,19 28.5,61 208.5,19
Holes 10 mm at -173,63
Holes 6.5 mm at -81.5,63.5
Holes 9.5 mm at -73,51.5 -73,40
Holes 4 mm at 120,14 120,22 120,27 120,32 120,37 120,42 120,47 120,52 120,57 120,62 120,67

### Footprints (pad centres in the part's own frame; a part is rotated, then mirrored left to right if it is on the bottom)
3RP/1610G = drill 1.2 pad 2.184: 1-1 -5,0; 1-2 0,0; 1-3 5,0; 2-1 -5,5; 2-2 0,5; 2-3 5,5
E5-6 = drill 0.813 pad 1.905: + -2.54,0 | drill 0.813 pad 1.905 octagon: - 2.54,0
C2.5-2 = drill 0.813 pad 1.6 octagon: 1 -1.27,0; 2 1.27,0
PCB2-M3 = drill 1.8: P$1 -3.75,-5; P$2 3.75,-5; P$3 3.75,-10; P$4 -3.75,-10
DO34Z7 = drill 0.813 long: A 3.81,0; C -3.81,0
3.81MM-3WAY-PLUGGABLE-SCREW = drill 1.3 long: 1 -3.81,8; 2 0,8; 3 3.81,8
3RP/1610N = drill 1.2 pad 2.184: 1 -5,0; 2 0,0; 3 5,0
1X03/90 = drill 1.016 long: 1 -2.54,-3.81; 2 0,-3.81; 3 2.54,-3.81
DIL08 = drill 0.813 pad 1.27: 1 -3.81,-3.81; 2 -1.27,-3.81; 3 1.27,-3.81; 4 3.81,-3.81; 5 3.81,3.81; 6 1.27,3.81; 7 -1.27,3.81; 8 -3.81,3.81
DIL18 = drill 0.813 long: 1 -10.16,-3.81; 2 -7.62,-3.81; 3 -5.08,-3.81; 4 -2.54,-3.81; 5 0,-3.81; 6 2.54,-3.81; 7 5.08,-3.81; 8 7.62,-3.81; 9 10.16,-3.81; 10 10.16,3.81; 11 7.62,3.81; 12 5.08,3.81; 13 2.54,3.81; 14 0,3.81; 15 -2.54,3.81; 16 -5.08,3.81; 17 -7.62,3.81; 18 -10.16,3.81
AUDIO_JACK_0.25"_TRS_PTH_RA = drill 1.6: RING 10.5,-6.95; RING-NORM 10.5,4.35; SLEEVE 4.2,-6.95; SLEEVE-NORM 4.2,4.35; TIP 16.8,-6.95; TIP-NORM 16.8,4.35 | hole 2.2: 7.4,4; 7.4,-6.6
RCA_LOCK = drill 2.3: PIN 4.03,3.802; SHELL 0.203,0; SWITCH 4.03,-3.827 | hole 2.134: -3.1,4.25; -3.1,-4.25
AUDIO-JACK-KIT = drill 1.3 pad 2.184: RING 5,5.1; RSH 5,2.5; SLEEVE 0,0; TIP 5,-5.1; TSH 5,-2.5 | hole 1.2: 0,5; -2.5,5; -2.5,-5; 0,-5; 5,0
LED3MM = drill 0.813 octagon: A -1.27,0; K 1.27,0
0204/7 = drill 0.813 octagon: 1 -3.81,0; 2 3.81,0
0207/10 = drill 0.813 octagon: 1 -5.08,0; 2 5.08,0
XKBENTERPRISESS-12D11G5R = drill 1.7: CENTER 0,-10.8; LEFT 4.8,-10.8; RIGHT -4.8,-10.8 | drill 1.6: P$1 -6.65,-1.58; P$2 6.65,-1.58
POT_B64W = drill 0.813 offset: A 2.64,0; E -2.64,0 | drill 0.813 long: S 0,-2.54

### Placement (x,y rotation side)
BASS1  64,42.5 270 top
C1  -126,75 90 top
C2  -123,24.5 0 top
C3  -123,29.5 0 top
C4  -130,44.5 270 top
C5  -123,2 0 top
C6  322,50 0 top
C7  322,43 0 top
C8  315,42 180 top
C9  315,38 180 top
C10  321.1,4.3 270 top
C11  91.5,37 0 top
C12  64,32 180 top
C13  77,59.5 0 top
C14  91.5,19 0 top
C15  -113,70 270 top
C16  -113,76 90 top
C17  87,70 270 top
C18  87,76 90 top
C19  -13,70 270 top
C20  -13,76 90 top
C21  169,76 90 top
C22  166,77 90 top
C23  268,69 270 top
C24  268,76 90 top
C25  327,70 270 top
C26  327,76 90 top
C29  71,32 180 top
C30  77,62.5 0 top
CON1  -40,75 90 top
CON2  -40,5 270 bottom
CON3  60,75 90 top
CON4  60,5 90 top
CON5  140,75 90 top
CON6  140,5 90 top
CON7  240,75 90 top
CON8  240,5 90 top
CON9  300,75 90 top
CON10  300,5 90 top
CON11  -140,5 90 top
CON12  -140,75 270 bottom
D1  -119.5,74 90 top
D2  -121.5,74 90 top
EQIN  100,59 90 top
EQOUT  100,7 90 top
EQVOL1  64,19 270 top
FADER  -136,19 270 top
FXGAIN  304,42.5 270 top
FXOUT1  329,4 270 top
GAIN1  -137,42.5 270 top
IC1  -123,43.5 90 top
IC2  -123,11 90 top
IC3  91.5,46 90 top
IC4  246.9,39.2 270 top
IC5  152.1,56 90 top
IC6  318,21 270 top
IC7  91.5,28 90 top
J1  -140,63 0 top
J2  -36,40 0 top
J3  -36,51.5 0 top
J4  -35.5,63.5 0 top
J5  300,61 0 top
LED1  143,22 90 top
LED2  143,27 90 top
LED3  143,32 90 top
LED4  143,37 90 top
LED5  143,42 90 top
LED6  143,47 90 top
LED7  143,52 90 top
LED8  143,57 90 top
LED9  143,62 90 top
LED10  143,67 90 top
LED11  307,31 270 top
LED12  303,31 90 top
LINE1  -36,19 270 top
LINEIN-OUT  0,7 90 top
LINEOUT  244,19 270 top
MIXER-OUT  269,4 270 top
MIXIN1  275,61 270 top
MIXIN2  269,53 270 top
MIXIN3  269,43 270 top
MIXIN4  269,35 270 top
MIXIN5  269,25 270 top
MIXIN6  269,15 270 top
PREAMPOUT  -100,7 90 top
PWRIN  -100,73 90 top
PWRIN1  100,73 90 top
PWRIN2  0,73 90 top
PWRIN3  180,73 90 top
PWRIN4  280,73 90 top
PWRIN5  340,73 90 top
R1  -114,57 270 top
R2  -123,34.5 180 top
R3  -123,32 180 top
R4  -123,37 0 top
R5  -123,50 0 top
R6  -123,17.5 0 top
R7  -123,20 0 top
R8  -123,4.5 180 top
R9  148.1,17.1 90 top
R10  315,49 180 top
R11  246.5,29.3 0 top
R12  259,69 0 top
R13  259,58 0 top
R14  259,48 0 top
R15  259,38 0 top
R16  259,28 0 top
R17  259,18 0 top
R18  247,49 0 top
R19  246.5,32.3 180 top
R20  258,66 0 top
R21  258,55 0 top
R22  258,45 0 top
R23  258,35 0 top
R24  258,25 0 top
R25  258,15 0 top
R26  247,46 0 top
R27  322,47 180 top
R28  322,40 180 top
R29  318,14 180 top
R30  315,45 0 top
R31  313,32 270 top
R32  91.5,34.5 180 top
R33  97.5,46 270 top
R34  77,47 0 top
R35  77,37 180 top
R36  77,42 0 top
R37  91.5,39.5 180 top
R38  77,44.5 0 top
R39  77,34.5 180 top
R40  77,39.5 0 top
R41  77,65.5 0 top
R42  77,54.5 180 top
R43  85.5,28 270 top
R44  91.5,16.5 180 top
R45  77,68 0 top
R46  77,57 180 top
R47  85.8,46 270 top
R48  97.5,25.5 270 top
R49  91.5,21.5 180 top
TREB1  64,61 270 top
U$1  300,19 90 top
U$2  170,53 270 top
U$5  141,14 90 top
VU-IN  169,66 270 top
VU-OUT  169,4 270 top

### Tracks (layer width: path | path; a pad name or v marks a point on that pad's centre or on a via)
+15V  (via drill 0.35)  (11 unrouted)
  Top 0.406: IC7.8 86.94,24.19 85.92,25.21 85.08,25.21 85.07,25.2 83.9,25.2 83.06,26.04 83.06,33.16 83.84,33.94 86.81,33.94 87.27,33.48 88.11,33.48 88.71,34.08 88.71,34.92 88.11,35.52 87.27,35.52 86.88,35.12 84.07,35.12 83.64,35.55 83.64,40.55 83.9,40.8 | 83.9,40.8 83.62,41.08 83.62,49.52 86.2,52.1 96.74,52.1 98.44,53.8 98.44,67.66 v98,68.1 | 83.9,40.8 86.3,40.8 IC3.8 | v97.6,69.93 95.47,69.93 94.5,70.9 94.5,74.31 PWRIN1.3 87.46,76.81 C18.2
  Top 0.813: 260.2,70.8 260.2,52.6 258.63,51.03 247.76,51.03 246.97,50.23 246.97,45 248.96,43.01 IC4.8 | IC2.8 -124.8,9.2 -124.8,20.6 -127.05,22.85 -127.05,29.35 -125,31.4 -125,38.9 -125.79,39.69 IC1.8 -124.6,41.9 -124.6,49 -120.8,52.8 -120.8,66.2 -117.6,69.4 -117.6,72.67 C16.2 -108.46,77.27 PWRIN.3
  Bottom 0.406: v98,68.1 97.6,68.5 v97.6,69.93
  Bottom 0.813: LED10.A 141.9,65.73 | 141.9,65.73 141.5,65.33 141.5,60.7 | LED1.A 141.87,20.73 141.5,21.1 141.5,25.8 | 141.5,60.7 141.5,55.7 | 141.5,55.7 141.5,50.7 | 141.5,50.7 141.5,45.6 | 141.5,45.6 141.5,40.7 | 141.5,40.7 141.5,35.6 | 141.5,35.6 141.5,30.8 | 141.5,30.8 141.5,25.8 | LED2.A 141.57,25.73 141.5,25.8 | LED3.A 141.57,30.73 141.5,30.8 | LED4.A 141.63,35.73 141.5,35.6 | LED5.A 141.53,40.73 141.5,40.7 | LED6.A 141.63,45.73 141.5,45.6 | LED7.A 141.53,50.73 141.5,50.7 | LED8.A 141.53,55.73 141.5,55.7 | LED9.A 141.53,60.73 141.5,60.7 | 141.9,65.73 141.5,66.13 141.5,69.1 142.1,69.7 143.8,69.7 146,67.5 149.63,67.5 150.97,66.16 | 150.97,66.16 IC5.9 155.91,70.78 158.59,73.46 | 327.9,56.6 327.9,17 324.9,14 R29.1 320.3,15.51 320.3,23.3 IC6.8 | IC5.3 152.28,50.92 150.4,52.8 150.4,65.58 150.97,66.16 | C20.2 -8.46,77.27 PWRIN2.3
-15V  (10 unrouted)
  Top 0.406: IC7.4 97.91,31.81 99,32.9 99,51.2 | 99,51.2 96.7,51.2 IC3.4 | 99,51.2 99,68.3 98.1,69.2 PWRIN1.1 87.46,69.19 C17.2
  Top 0.813: 258.27,71.6 258.27,53.4 257.87,53 247,53 245,51 245,37.3 IC4.4 | IC2.4 -122.4,18.02 -122.4,26.1 -120.37,28.13 -120.37,31.17 -121,31.8 -121,46.2 | IC1.4 -119.89,47.31 -121,46.2 | -121,46.2 -121,51.23 -119.83,52.4 -119.83,65.8 -116.91,68.73 C15.2 -108.46,68.73 PWRIN.1
  Bottom 0.813: 328.9,62.3 328.9,16.5 325.18,12.78 321.31,12.78 320.59,13.49 320.59,13.85 317.25,17.19 IC6.4 | C19.2 -8.46,68.73 PWRIN2.1
EQ-CH1
  Bottom 0.406: C14.2 95.27,21.5 R49.1 IC7.1 92.91,24.19 88.71,28.39 88.71,29.69 88.11,30.29 85.21,30.29 83.5,32 83.5,35.62 82.94,36.18 82.94,37.16 81.9,38.2 81.9,43.41 R38.2 79.68,45.63 79.68,47.81 83.58,51.71 83.58,55.79 82.94,56.43 82.94,57.88 81.69,59.13 81.06,59.13 79.56,60.64 79.56,64.25 R41.2
EQ-CH2
  Bottom 0.406: C11.2 95.27,39.5 R37.1 IC3.1 93.79,43.71 87.27,43.71 83.98,47 R34.2 80.81,48.15 84.14,51.47 84.14,56.03 83.5,56.66 83.5,58.12 81.92,59.69 81.29,59.69 80.12,60.87 80.12,64.02 80.58,64.48 81.23,64.48 81.83,65.08 81.83,65.92 80.81,66.94 R45.2
FX-BUFFER
  Bottom 0.813: R31.1 312,36.81 312,39 306.96,44.03 306.6,44.03 305.63,45 303,45 300.9,42.9 300.9,29.2 301.8,28.3 308.24,28.3 310,26.54 310,24.6 U$1.LEFT 308.8,21.8 308.8,13.3 309.9,12.2 312.54,12.2 313.3,11.44 314.6,11.44 320.46,5.57 C10.1
FXOUT1
  Bottom 0.813: FXOUT1.3 326.46,1.46 327.4,2.4 327.4,5.9 326.7,6.6 325.25,6.6 FXOUT1.1 322.07,6.54 321.61,7 320.4,7 315,12.4 313.7,12.4 312.8,13.3 312.8,15.12 311.83,16.09 311.83,17.96 U$1.CENTER
GND  (via drill 0.35)  (22 unrouted)
  Top 0.406: v94.5,23 96.19,23 R48.2 | v94.58,41 96.31,41 R33.2 | v72.52,23.48 69.52,23.48 EQVOL1.2-1 | C17.1 88.27,71.27 90,73 | 90,73 PWRIN1.2 | C18.1 88.27,74.73 90,73
  Top 0.813: 267.8,64.39 267.8,53 | 267.8,53 267.8,43 | 267.8,43 267.8,35.1 | 267.8,35.1 267.8,25 | 267.8,25 267.8,15 | 267.8,15 267.8,4.8 267,4 MIXER-OUT.2 | MIXIN6.2 267.8,15 | MIXIN5.2 267.8,25 | MIXIN4.2 267.7,35 267.8,35.1 | MIXIN3.2 267.8,43 | MIXIN2.2 267.8,53 | MIXIN1.2 267.8,64.39 | 267.8,65.2 267.8,64.39 | 259.24,71.2 259.24,53 258.24,52 247.37,52 246,50.63 246,35.61 R19.2 247.31,32.3 R11.2 250.31,25.31 LINEOUT.2-1 LINEOUT.1-1 241.9,21.9 241.9,11 244.15,8.75 CON8.P$2 CON8.P$1 | -34,22 -34,11.2 -35,10.2 CON2.P$1 CON2.P$2 | -34,22 LINE1.1-1 -36,35.9 -31.97,39.93 J2.PIN | -34,22 -32,24 LINE1.2-1 | J3.PIN -32.8,56.13 -32.8,60.8 J4.SLEEVE | -134.3,3.9 -129,3.9 -128,2.9 -125.9,2.9 -125,3.8 -120.9,3.8 -120.1,3 -117.8,3 -113.8,7 PREAMPOUT.2 | -134.3,3.9 -135,3.2 CON11.P$1 -135,1 | -134.3,3.9 -135,4.6 CON11.P$2 -138.1,11.85 -138.1,21.9 FADER.1 | 328.6,60 328.6,5.3 327.3,4 FXOUT1.2 | 163.4,76 162.9,75.5 162.9,66.6 163.5,66 VU-IN.2 | CON12.P$1 -135,75.9 -133.8,74.7 -135,73.5 CON12.P$2 | PWRIN.2 -111.27,73 | -111.27,73 C16.1 | C15.1 -111.27,73
  Bottom 0.406: 62.5,11.25 62.5,16.87 61.44,17.94 61.44,20.06 64,22.63 EQVOL1.1-1 EQVOL1.2-1 | R33.2 98.83,42.19 | 98.83,42.19 99.02,42 99.02,22 98.71,21.69 | R48.2 98.71,21.69 | v94.5,23 94.75,22.75 94.75,22.38 94.29,21.92 94.29,21.31 93.14,20.16 89.84,20.16 88.71,21.29 88.71,21.92 88.11,22.52 87.17,22.52 R43.2 85.5,27.63 82.03,31.1 79.89,31.1 72.52,23.73 v72.52,23.48 | R47.2 85.8,41.7 86.98,40.52 88.11,40.52 88.71,39.92 88.71,39.31 89.86,38.16 93.14,38.16 94.29,39.31 94.29,39.92 94.75,40.38 94.75,40.83 v94.58,41 | EQOUT.2 97.4,7 99.02,8.62 99.02,21.38 98.71,21.69 | 98.83,42.19 99,42.36 99,58.4 98.4,59 | EQIN.2 98.4,59 | 98.4,59 99,59.6 99,71.6 97.6,73 PWRIN1.2
  Bottom 0.813: C2.- -119.19,23.23 R7.2 -113.1,20 | J3.PIN -31,55.3 -29.5,53.8 -29.5,44.1 -29.8,43.8 J2.PIN | J4.SLEEVE -32.9,66.1 -32.9,69.15 CON1.P$1 -35,75.7 -34.7,76 | -111.5,60.81 -111.5,50.2 | R5.2 -118.99,50.2 -111.5,50.2 | -111.5,60.81 R1.1 -116,60.81 -117.31,59.5 -134.5,59.5 -135.8,58.2 J1.SLEEVE | VU-OUT.2 164.9,4 162.1,1.2 153.1,1.2 151,3.3 145.5,3.3 | 145.5,3.3 145,2.8 CON6.P$1 | 145,12.54 U$5.S 141,16.54 U$5.A 144.8,20.44 144.8,23.7 145.56,24.47 145.56,28.11 146.33,28.87 146.33,32.51 147.3,33.47 147.3,37.11 148.16,37.97 148.16,41.61 151.06,44.5 157.2,44.5 157.8,45.1 157.8,46.7 156.12,48.38 IC5.2 155.98,48.38 157.9,50.3 157.9,51.47 IC5.4 154.35,51.9 152.66,51.9 151.4,53.16 151.4,61.5 152.3,62.4 157.27,62.4 160.87,66 VU-IN.2 | 306.88,3.33 310.87,3.33 313.27,0.93 320.2,0.93 321.1,1.83 C10.2 322.07,4 FXOUT1.2 | 306.88,3.33 305,5.22 CON10.P$2 | R10.1 314,49 311,52 308.57,52 308.44,51.88 306.36,51.88 304.88,53.35 304.88,53.37 J5.SLEEVE 301.6,56.65 301.6,67.85 CON9.P$1 305,73.25 307.75,76 CON9.P$2 | R27.2 318.81,47.62 R10.1 | C6.1 319.73,49 R10.1 | 146.5,76 145,74.5 CON5.P$1 | 146.5,76 150.3,76 153,78.7 161.9,78.7 164.6,76 | 146.5,76 145,77.5 CON5.P$2 | 145.5,3.3 145,3.8 CON6.P$2 | CON1.P$2 -35,76.3 -34.7,76 | 62.5,11.25 CON4.P$2 CON4.P$1 | CON3.P$1 CON3.P$2 | CON7.P$2 245,77.1 246.1,76 245,74.9 CON7.P$1 | CON10.P$1 305,1.45 306.88,3.33 | D1.A -116.08,77.81 C16.1 | C15.1 -111.5,69.77 -111.5,60.81 | -111.5,50.2 -111.5,21.6 -113.1,20 | PREAMPOUT.2 -106.2,7 -104.7,8.5 -104.7,11.6 -113.1,20 | -34.7,76 -14.27,76 C20.1 -13,73 | -13,73 C19.1 | PWRIN2.2 -13,73
GUITARIN1  (via drill 0.35)
  Top 0.813: v315.5,18.8 315.2,18.5 313.6,18.5 310.8,15.7 U$1.RIGHT
  Bottom 0.813: J5.RING J5.TIP 318.85,52 321.27,52 C6.2 325.81,47.46 R27.1 325.81,45.54 C7.2 322.85,43 321.39,44.46 320.07,44.46 319.17,43.56 319.17,40.94 319.41,40.7 319.41,39.35 319.15,39.1 319.15,24.83 316.56,22.23 316.56,20.73 315.5,19.68 v315.5,18.8
LEFT1
  Bottom 0.813: MIXIN1.1 268.27,63.54 R12.2
LEFT2
  Bottom 0.813: MIXIN2.1 265.19,55.62 R13.2
LEFT3
  Bottom 0.813: MIXIN3.1 265.19,45.62 R14.2
LEFT4
  Bottom 0.813: MIXIN4.1 263.27,37.54 R15.2
LEFT5
  Bottom 0.813: MIXIN5.1 263.27,27.54 R16.2
LEFT6
  Bottom 0.813: MIXIN6.1 263.27,17.54 R17.2
LEFT-IN
  Top 0.813: VU-OUT.1 167.18,6.54 169.1,8.46 169.1,42.9 166.6,45.4 166.6,47.3 169,49.7 169,56.2 166.6,58.6 166.6,60.7 168.9,63 168.9,67.1 167.46,68.54 VU-IN.1
  Bottom 0.813: VU-IN.1 166.46,68.54 167.4,67.6 167.4,62.6 166.7,61.9 164.97,61.9 161.2,58.13 161.2,52.1 160.1,51 160.1,49.1 U$2.LEFT
LEFT-MIX
  Top 0.813: R14.1 251.81,48 R18.2
  Bottom 0.813: R17.1 255.19,24.28 255.41,24.5 255.41,25.5 255.19,25.72 R16.1 255.19,34.28 255.41,34.49 255.41,35.51 255.19,35.72 R15.1 255.19,44.28 255.41,44.49 255.41,45.51 255.19,45.72 R14.1 255.19,54.28 255.41,54.49 255.41,55.51 255.19,55.72 R13.1 255.19,65.28 255.41,65.5 255.41,66.5 255.19,66.72 R12.1 | IC4.2 243.09,41.29 244.31,42.51 244.31,43.52 243.09,44.73 242.67,44.73 241.97,45.43 241.97,46.55 242.7,47.28 243.5,47.28 245.21,49 R18.2
MIC1
  Top 0.813: C1.+ -126,58.85 | -126,58.85 J1.TIP | J1.RING -128.8,56.05 -126,58.85
MIX-OUT-L
  Bottom 0.813: LINEOUT.1-3 242.1,14 240.9,15.2 240.9,43 | IC4.1 240.91,43.01 240.9,43 | 240.9,43 240.9,48.01 241.89,49 R18.1
MIX-OUT-R
  Bottom 0.813: LINEOUT.2-3 252,17 252,40 251.53,40.47 IC4.7 249.62,40.47 244.09,46 R26.1
N$1
  Bottom 0.813: D2.A -121.77,77.54 C1.- -127.54,76 -135,76 -138,73 -138,52.5 -137,51.5 -121.31,51.5 -121.2,51.39 | IC1.3 -121.2,46.78 -121.2,51.39 | R1.2 -119.4,53.19 -121.2,51.39
N$2
  Bottom 0.813: R2.2 -128.2,33.11 -128.2,31.1 -125.54,28.44 C2.+
N$3
  Bottom 0.813: IC1.2 -120.6,40.82 -120.6,35.91 R2.1 -119.27,34.5 C3.1 -126.77,32 R3.2
N$4
  Bottom 0.813: IC1.1 R4.2 -117.8,35.61 -117.8,33.43 -119.23,32 | C3.2 -119.23,32 | -119.23,32 R3.1
N$5
  Bottom 0.813: R4.1 -125.4,38.41 -125.4,43.36 IC1.6 -127.81,45.77 C4.1 -135.27,45.77 GAIN1.1
N$6
  Bottom 0.813: IC1.5 R5.1
N$7
  Bottom 0.813: -127,42.23 IC1.7 | FADER.3 -138.1,16.1 -138.1,20.4 -137.3,21.2 -135.16,21.2 -133.7,22.66 -130.04,22.66 -126.5,26.2 -126.5,28.04 -129.16,30.7 -129.16,33.51 -128.2,34.48 -128.2,41.03 -127,42.23 | -127,42.23 -128,43.23 C4.2 -136.27,43.23 GAIN1.2
N$8
  Bottom 0.813: R7.1 -123.06,20 -121,17.95 -121,13.6 -119.67,12.27 IC2.3
N$9
  Bottom 0.813: D1.C D2.C
N$10
  Bottom 0.813: R6.1 -125.28,19.04 -123.45,19.04 -121.97,17.55 -121.97,13.2 -120.3,11.54 -120.3,10.84 IC2.2 -124.27,4.65 C5.1 -126.77,4.5 R8.2
N$11
  Bottom 0.406: EQVOL1.2-2 81.46,6.54 88.44,6.54 92,10.1 EQOUT.3
N$12
  Bottom 0.406: IC3.3 97.5,49.46 R33.1
N$13
  Bottom 0.813: R19.1 250.31,34.99 IC4.5
N$14
  Bottom 0.813: R11.1 245,31.61 245,36.02 IC4.3
N$15
  Bottom 0.406: 93.25,35.84 92.29,35.84 91.14,37 C11.1 87.73,39.5 R37.2 | 93.25,35.84 93.93,36.52 93.93,37.37 95.04,38.48 95.73,38.48 96.33,39.08 96.33,39.92 95.87,40.38 95.87,41.31 96.33,41.77 96.33,42.61 95.31,43.63 IC3.2 | R32.1 94.59,34.5 93.25,35.84
N$16
  Bottom 0.813: LINE1.2-2 -31,17.27 -30.7,16.96 -29.04,16.96 -18.61,6.54 -12.66,6.54 -8.39,10.81 LINEIN-OUT.3
N$17
  Bottom 0.813: LINE1.1-2 -33,16 -29.44,16 -19.02,5.58 -13,5.58 -12.78,5.58 -10.39,3.19 LINEIN-OUT.1
N$18
  Bottom 0.813: R6.2 -123.39,21.7 -133.3,21.7 FADER.2
N$19
  Bottom 0.813: J4.RING -28.3,66.4 -28.3,42.1 -30.6,39.8 -35.6,39.8 | -35.6,39.8 J2.SHELL | LINE1.1-3 -37.8,15.8 -37.8,29.1 -34.8,32.1 -34.8,39 -35.6,39.8
N$20
  Bottom 0.813: J4.TIP -30.78,58.12 -32.99,58.12 -35.8,55.31 J3.SHELL -35.8,43.6 -38.01,41.39 -38.01,38.61 -35.77,36.37 -35.77,32.5 -38.77,29.5 -38.77,14.43 -36.68,12.35 -35.32,12.35 -33.66,14 LINE1.2-3
N$21
  Bottom 0.813: LINEOUT.2-2 248.2,19 246.95,17.75 246.95,12.82 247.82,11.95 259.78,11.95 MIXER-OUT.1
N$22
  Bottom 0.813: MIXER-OUT.3 264.04,1.46 263,2.5 263,7.37 259.38,10.98 247.42,10.98 245.98,12.42 245.98,17.75 244.73,19 LINEOUT.1-2
N$23
  Top 0.406: R32.2 83.9,34.5 83.06,35.34 83.06,49.75 85.97,52.66 93.46,52.66 94.7,53.9 94.7,60.11 EQIN.3
N$24  (via drill 0.35)
  Top 0.813: v163.4,57.4 160.9,59.9 v159.8,59.9
  Bottom 0.813: R9.2 147.5,22.78 147.5,27.31 148.26,28.07 148.26,31.71 149.23,32.67 149.23,36.31 150.09,37.17 150.09,40.81 151.85,42.57 158,42.57 162.06,46.63 162.06,50.23 163.13,51.3 163.13,57.13 v163.4,57.4 | IC5.7 157.22,61.08 158.4,59.9 | IC5.6 157.04,58.54 158.4,59.9 | 158.4,59.9 v159.8,59.9
N$25
  Bottom 0.813: LED1.K 144.6,24.87 144.6,28.5 145.37,29.27 145.37,32.91 146.33,33.87 146.33,37.5 147.2,38.37 147.2,42.01 150.66,45.47 155.53,45.47 IC5.1
N$26
  Bottom 0.813: LED2.K 144.4,29.67 144.4,33.3 145.37,34.27 145.37,37.1 145.36,37.1 145.36,37.9 146.23,38.77 146.23,42.41 147.3,43.47 147.3,45.1 148.04,45.84 IC5.18
N$27
  Bottom 0.813: IC5.17 147.21,48.38 146.33,47.51 146.33,43.87 145.26,42.8 145.26,39.17 144.4,38.3 144.4,36.7 144.4,34.67 LED3.K
N$28
  Bottom 0.813: IC5.16 147.15,50.92 146.23,50 146.23,48.77 145.37,47.91 145.37,44.27 144.3,43.2 144.3,39.57 LED4.K
N$29
  Bottom 0.813: IC5.15 146.09,53.46 145.26,52.63 145.26,49.17 144.4,48.3 144.4,44.67 LED5.K
N$30
  Bottom 0.813: IC5.14 145.66,56 145.26,55.6 145.26,54 144.3,53.03 144.3,49.57 LED6.K
N$31
  Bottom 0.813: IC5.13 145.64,58.54 144.3,57.2 144.3,54.4 143.17,53.27 LED7.K
N$32
  Bottom 0.813: IC5.12 145.81,61.08 LED8.K
N$33
  Bottom 0.813: IC5.11 143.35,63.62 LED9.K
N$34
  Bottom 0.813: IC5.10 145.11,66.16 LED10.K
N$35
  Bottom 0.813: R29.2 314.19,15.2 312.9,16.49 312.9,17.84 314.19,19.13 IC6.3 315.59,21.13 315.59,22.63 318.19,25.23 R28.2
N$36
  Bottom 0.406: R38.1 71.64,46.05 68.4,46.05 66.95,47.5 BASS1.1-1 62.5,46 62.5,32.23 C12.2
N$37
  Bottom 0.813: R28.1 323.73,40 C7.1
N$38
  Bottom 0.813: LED12.A LED11.K 308.18,29.73 310.68,27.23 312.1,27.23 312.9,26.43 312.9,23.56 IC6.2 314.19,22.59 317.23,25.63 317.23,36.77 316.27,37.73 C9.1 C8.1 316.27,42.46 R30.2
N$39
  Bottom 0.813: C9.2 314.35,38 315.71,36.64 315.99,36.64 316.26,36.38 316.26,29.3 | FXGAIN.2 302.5,42.5 302,42 302,33.27 LED12.K LED11.A 311.08,28.19 R31.2 315.15,28.19 316.26,29.3 | 316.26,29.3 316.26,26.03 315.04,24.81 IC6.1
N$40
  Bottom 0.813: C8.2 313.73,46.46 R10.2
N$41
  Bottom 0.813: R30.1 307.5,45 305,47.5 FXGAIN.1
N$42
  Bottom 0.406: R39.2 71.64,36.05 68.4,36.05 66.95,37.5 BASS1.1-3 64,33.27 C12.1
N$43
  Bottom 0.406: BASS1.2-1 72.69,47.5 R34.1 74.5,45.69 74.5,35.42 74.77,35.15 74.77,33.7 73.43,32.37 73.43,31.52 72.75,30.84 71.79,30.84 70.64,32 C29.2
N$44
  Bottom 0.406: BASS1.2-3 72.69,37.5 R35.2 73.19,35.94 74.21,34.92 74.21,33.94 C29.1
N$45
  Bottom 0.406: BASS1.1-2 66.95,42.5 68.4,41.05 71.64,41.05 R40.1
N$46
  Bottom 0.406: BASS1.2-2 72.69,42.5 R36.1
N$47
  Bottom 0.406: C13.2 79.75,58.02 81.23,58.02 81.83,57.42 81.83,55.96 82.46,55.33 82.46,52.17 78.56,48.27 78.56,40.75 79.81,39.5 R40.2 80.81,38.44 82.38,36.87 82.38,35.95 82.94,35.38 82.94,31.77 84.98,29.73 86.91,29.73 87.37,29.27 IC7.6
N$48
  Bottom 0.406: TREB1.1-2 66.95,61 68.4,59.55 75.68,59.55 C13.1
N$49  (via drill 0.35)
  Top 0.406: v80.85,62.5 C30.2
  Bottom 0.406: R36.2 80.12,42 79.12,43 79.12,48.04 83.02,51.94 83.02,55.56 82.39,56.2 82.39,57.65 81.46,58.58 80.83,58.58 79,60.4 79,61.77 C30.2 | IC3.6 84.68,47.27 84.06,47.89 84.06,50.61 84.69,51.24 84.69,56.26 84.06,56.89 84.06,58.35 82.16,60.25 81.52,60.25 80.68,61.1 80.68,62.33 v80.85,62.5
N$50  (via drill 0.35)
  Top 0.406: v81.65,36.15 81.65,35.34 R39.1
  Bottom 0.406: EQVOL1.1-3 64,16.16 61.99,18.17 61.99,19.83 63.17,21.01 68.22,21.01 80.81,33.6 R39.1 79.5,35.81 79.5,37.52 78.94,38.08 78.94,38.79 77.44,40.29 77.44,48.73 81.34,52.63 81.34,53.97 R42.1 | v81.65,36.15 81.65,35.89 82.39,35.15 82.39,31.54 84.75,29.17 86.33,29.17 87.69,27.81 IC7.7
N$51
  Bottom 0.406: TREB1.1-3 66.95,56 68.4,54.55 73.14,54.55 R42.2
N$52
  Bottom 0.406: TREB1.2-2 74.23,61 C30.1
N$53
  Bottom 0.406: TREB1.1-1 66.95,66 68.4,64.55 72.24,64.55 R41.1
N$54
  Bottom 0.406: R43.1 IC7.5
N$55  (via drill 0.35)
  Top 0.406: v81.41,61.5 80.81,60.9 R46.1
  Bottom 0.406: EQVOL1.2-3 66.06,16.94 64.01,16.94 62.55,18.4 62.55,19.6 63.4,20.45 68.45,20.45 81.83,33.83 81.83,34.92 80.81,35.94 R35.1 79.5,38.31 79.5,39.02 78,40.52 78,48.5 81.9,52.4 81.9,55.1 80.81,56.19 R46.1 | IC3.7 87.69,45.83 88.71,46.85 88.71,47.69 88.11,48.29 87.27,48.29 86.81,47.83 84.91,47.83 84.62,48.12 84.62,50.38 85.25,51.01 85.25,56.49 84.62,57.12 84.62,58.58 84.55,58.65 82.39,60.81 81.75,60.81 81.41,61.16 v81.41,61.5
N$56
  Bottom 0.406: EQVOL1.1-2 65.5,17.5 69.71,17.5 81.23,5.98 88.42,5.98 91.21,3.19 EQOUT.1
N$57
  Bottom 0.406: TREB1.2-3 72.19,56 R46.2
N$58
  Bottom 0.406: TREB1.2-1 71.19,66 R45.1
N$59  (1 unrouted)
  Bottom 0.406: IC7.3 97.56,29.27
N$60
  Bottom 0.406: 93.93,17.88 93.93,19.36 95.04,20.48 95.73,20.48 96.33,21.08 96.33,21.92 95.87,22.38 95.87,23.31 96.33,23.77 96.33,24.61 95.31,25.63 IC7.2 | R44.1 93.93,17.88 | 93.93,17.88 93.89,17.84 92.29,17.84 91.14,19 C14.1 90.19,19 R49.2
N$61
  Top 0.406: R44.2 86.2,17.99 86.2,22 82.5,25.7 82.5,49.98 85.74,53.22 90.03,53.22 EQIN.1
N$62  (via drill 3.2)
  other vias: -180,75
N$63  (via drill 3.2)
  other vias: -180,5
N$64  (via drill 3.2)
  other vias: -80,75
N$65
  Bottom 0.406: R47.1 IC3.5
N$66  (via drill 3.2)
  other vias: -80,5
N$67  (via drill 3.2)
  other vias: 20,75
N$68  (via drill 3.2)
  other vias: 20,5
N$69  (via drill 3.2)
  other vias: 120,75
N$70  (via drill 3.2)
  other vias: 120,5
N$71  (via drill 3.2)
  other vias: 200,75
N$72  (via drill 3.2)
  other vias: 200,5
PREAMP1
  Top 0.813: PREAMPOUT.3 -106.37,10.81 -104.89,9.34 -104.89,4.57 -106.27,3.19 PREAMPOUT.1
  Bottom 0.813: -121.19,1.46 C5.2 -119.23,4.5 R8.1 IC2.1 -111.62,7.19 PREAMPOUT.3
REF
  Top 0.813: U$5.E 147.44,11.36 R9.1
  Bottom 0.813: R9.1 146.88,12.02 145.1,13.8 145.1,19.38 145.76,20.04 145.76,23.3 146.53,24.07 146.53,27.7 147.3,28.47 147.3,32.11 148.26,33.07 148.26,36.71 149.13,37.57 149.13,41.21 151.46,43.53 157.6,43.53 161.1,47.03 161.1,50.63 162.16,51.7 162.16,57.73 165.37,60.94 167.1,60.94 168.37,62.2 168.37,68 166.5,69.86 163.56,69.86 163,69.3 163,67.9 162.06,66.97 160.47,66.97 157.12,63.62 IC5.8
RIGHT1
  Bottom 0.813: MIXIN1.3 269.35,58.46 R20.2
RIGHT2
  Bottom 0.813: MIXIN2.3 265.19,51.62 R21.2
RIGHT3
  Bottom 0.813: MIXIN3.3 265.19,41.62 R22.2
RIGHT4
  Bottom 0.813: MIXIN4.3 264.35,32.46 R23.2
RIGHT5
  Bottom 0.813: MIXIN5.3 264.35,22.46 R24.2
RIGHT6
  Bottom 0.813: MIXIN6.3 264.35,12.46 R25.2
RIGHT-IN
  Top 0.813: VU-IN.3 165.63,63.02 165.63,58.2 168.03,55.8 168.03,50.1 165.63,47.7 165.63,45 168.13,42.5 168.13,9.34 166.9,8.1 163.7,8.1 162.9,7.3 162.9,2.1 163.54,1.46 VU-OUT.3
  Bottom 0.813: U$2.RIGHT 159.5,57.8 165.16,63.46 VU-IN.3
RIGHT-MIX
  Top 0.813: IC4.6 253.64,35 R23.1
  Bottom 0.813: R20.1 254.19,58.72 253.97,58.51 253.97,57.49 254.19,57.28 R21.1 254.19,48.72 253.97,48.51 253.97,47.49 254.22,47.24 254.22,45.23 254,45 R22.1 | R22.1 254.22,44.97 254.22,38.76 253.97,38.51 253.97,37.49 254.22,37.24 254.22,35.03 R23.1 254.19,28.72 253.97,28.5 253.97,27.5 254.22,27.24 254.22,25.04 R24.1 254.19,18.72 253.97,18.5 253.97,17.5 254.19,17.28 R25.1 | R22.1 252,45 251,46 R26.2
SIG
  Bottom 0.813: U$2.CENTER 159.2,54.5 157.7,56 IC5.5

### Text on the board
tPlace: MIC PREAMP | LINE-IN | BAXANDALL EQ | VU METER | MIXER | GUITAR IN | Other ideas: / / / 555 Metronome / Guitar Tuner / 15-0-15v PSU (See OLD folder of this project) or TEN 3-2423 Module / Headphone Amp Passthrough / spare NE5532 output on OverDrv for something? / FX Patching? | OUTPUT | L/G/R | OUTPUT | L/G/R | OUTPUT | L/G/R | Todo: / Remove Pot / Add more ports | Todo: / Mic > Instrument > Line / Leave effects to the Pedals | Todo: / Nothing | Todo: / Nothing | Todo: / Nothing | Todo: / 3.81mm terminals | Todo: / 3.81mm terminals | Todo: / 3.81mm terminals